# Altium project stratixboard.PrjPCB (part 1 of 2)
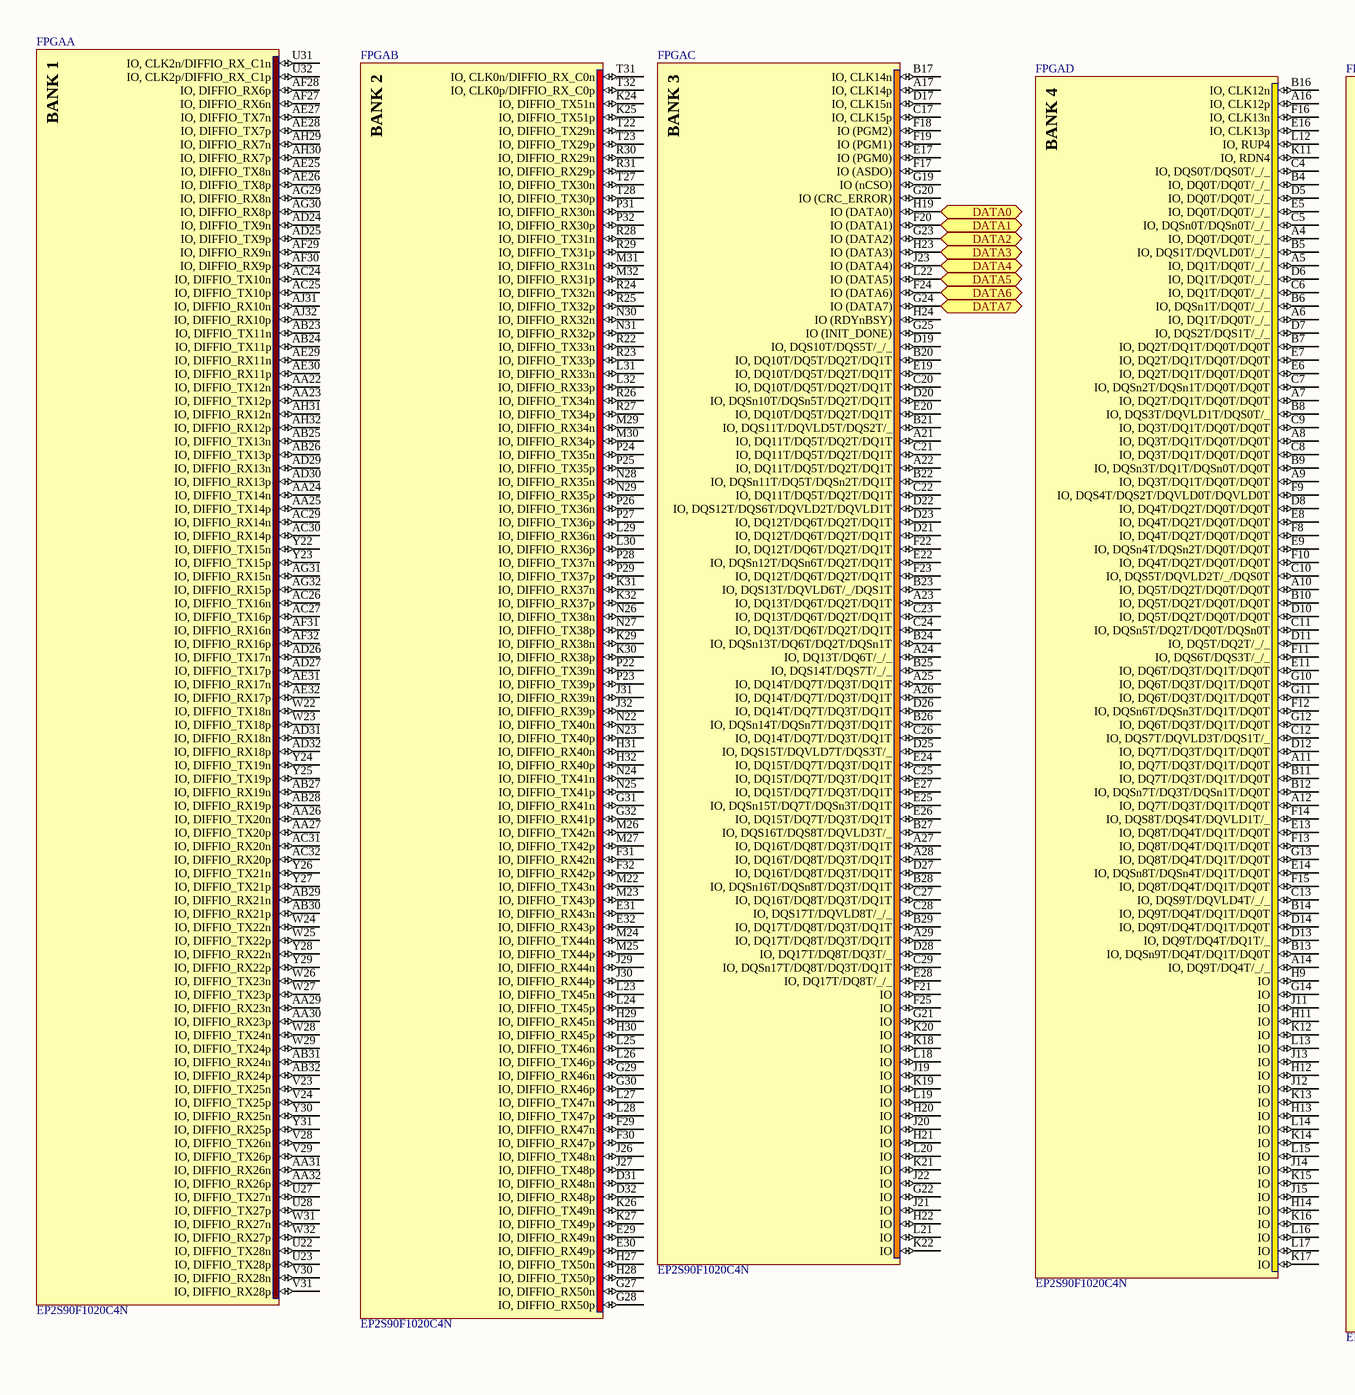
[diagram p0: IO.SchDoc, left]
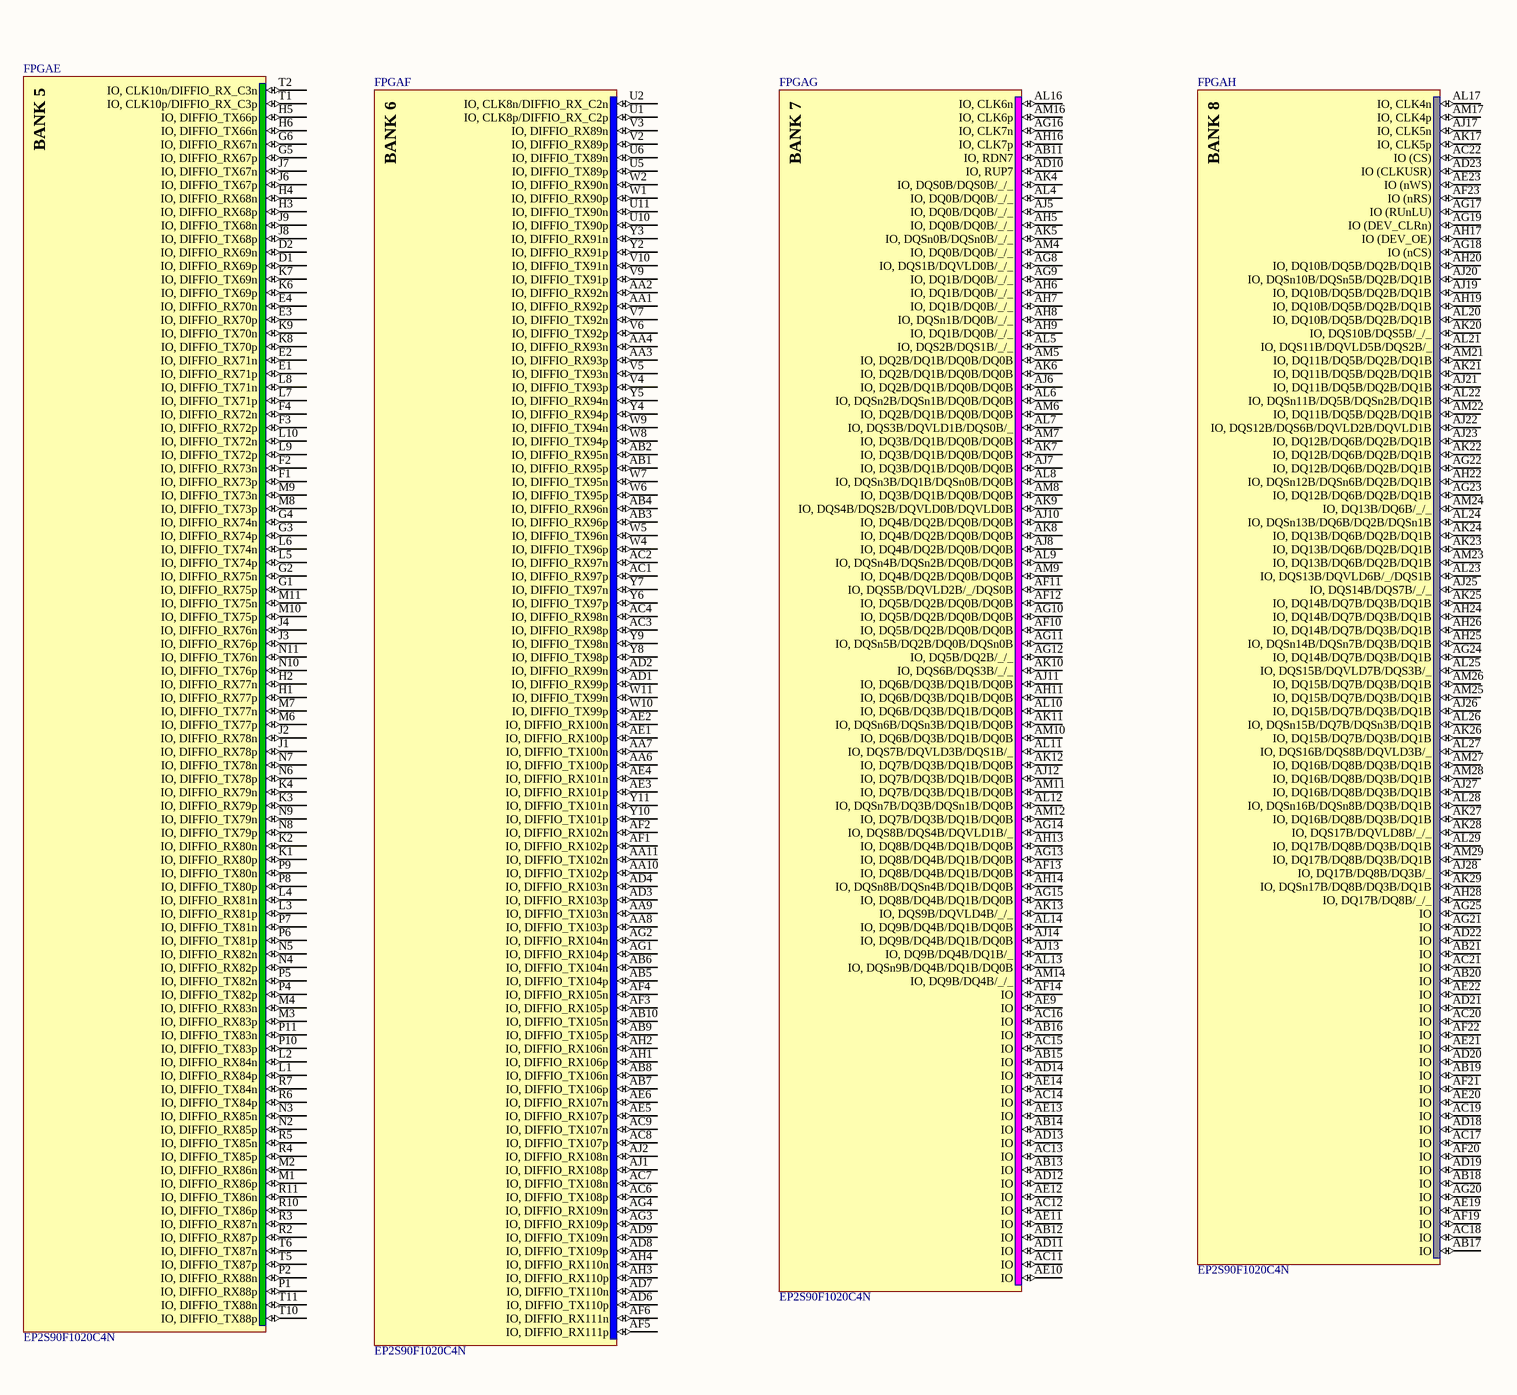
[diagram p1: IO.SchDoc, right]
8 sheets, 167 parts. Net scope: flat (ports and power ports of the same name join across sheets).
Board file: first_test.PcbDoc
Sheets:
  IO.SchDoc
  power_supply.SchDoc
  clk.SchDoc
  configuration.SchDoc
  arm.SchDoc
  ethernet.SchDoc
  memory.SchDoc
  decoupling.SchDoc

## Sheet IO.SchDoc
size A1

### Parts
FPGA  EP2S90F1020C4N  [FBGA1020]  (parts A,B,C,D,E,F,G,H of 18)

### Ports
DATA0, DATA1, DATA2, DATA3, DATA4, DATA5, DATA6, DATA7

### Nets
NetARM_66: FPGA.G24(IO_(DATA7)) ; port DATA7
NetARM_67: FPGA.F24(IO_(DATA6)) ; port DATA6
NetARM_68: FPGA.L22(IO_(DATA5)) ; port DATA5
NetARM_69: FPGA.J23(IO_(DATA4)) ; port DATA4
NetARM_70: FPGA.H23(IO_(DATA3)) ; port DATA3
NetARM_73: FPGA.G23(IO_(DATA2)) ; port DATA2
NetARM_74: FPGA.F20(IO_(DATA1)) ; port DATA1
NetARM_75: FPGA.H19(IO_(DATA0)) ; port DATA0

Not connected (* = marked no-connect by the designer): FPGA A4(IO,_DQ0T/DQ0T/_/_) A5(IO,_DQ1T/DQ0T/_/_) A6(IO,_DQ1T/DQ0T/_/_) A7(IO,_DQ2T/DQ1T/DQ0T/DQ0T) A8(IO,_DQ3T/DQ1T/DQ0T/DQ0T) A9(IO,_DQ3T/DQ1T/DQ0T/DQ0T) A10(IO,_DQ5T/DQ2T/DQ0T/DQ0T) A11(IO,_DQ7T/DQ3T/DQ1T/DQ0T) A12(IO,_DQ7T/DQ3T/DQ1T/DQ0T) A14(IO,_DQ9T/DQ4T/_/_) A16(IO,_CLK12p) A17(IO,_CLK14p) A21(IO,_DQ11T/DQ5T/DQ2T/DQ1T) A22(IO,_DQ11T/DQ5T/DQ2T/DQ1T) A23(IO,_DQ13T/DQ6T/DQ2T/DQ1T) A24(IO,_DQ13T/DQ6T/_/_) A25(IO,_DQ14T/DQ7T/DQ3T/DQ1T) A26(IO,_DQ14T/DQ7T/DQ3T/DQ1T) A27(IO,_DQ16T/DQ8T/DQ3T/DQ1T) A28(IO,_DQ16T/DQ8T/DQ3T/DQ1T) A29(IO,_DQ17T/DQ8T/DQ3T/DQ1T) AA1(IO,_DIFFIO_RX92p) AA2(IO,_DIFFIO_RX92n) AA3(IO,_DIFFIO_RX93p) AA4(IO,_DIFFIO_RX93n) AA6(IO,_DIFFIO_TX100p) AA7(IO,_DIFFIO_TX100n) AA8(IO,_DIFFIO_TX103p) AA9(IO,_DIFFIO_TX103n) AA10(IO,_DIFFIO_TX102p) AA11(IO,_DIFFIO_TX102n) AA22(IO,_DIFFIO_TX12n) AA23(IO,_DIFFIO_TX12p) AA24(IO,_DIFFIO_TX14n) AA25(IO,_DIFFIO_TX14p) AA26(IO,_DIFFIO_TX20n) AA27(IO,_DIFFIO_TX20p) AA29(IO,_DIFFIO_RX23n) AA30(IO,_DIFFIO_RX23p) AA31(IO,_DIFFIO_RX26n) AA32(IO,_DIFFIO_RX26p) AB1(IO,_DIFFIO_RX95p) AB2(IO,_DIFFIO_RX95n) AB3(IO,_DIFFIO_RX96p) AB4(IO,_DIFFIO_RX96n) AB5(IO,_DIFFIO_TX104p) AB6(IO,_DIFFIO_TX104n) AB7(IO,_DIFFIO_TX106p) AB8(IO,_DIFFIO_TX106n) AB9(IO,_DIFFIO_TX105p) AB10(IO,_DIFFIO_TX105n) AB11(IO,_RDN7) AB12(IO) AB13(IO) AB14(IO) AB15(IO) AB16(IO) AB17(IO) AB18(IO) AB19(IO) AB20(IO) AB21(IO) AB23(IO,_DIFFIO_TX11n) AB24(IO,_DIFFIO_TX11p) AB25(IO,_DIFFIO_TX13n) AB26(IO,_DIFFIO_TX13p) AB27(IO,_DIFFIO_RX19n) AB28(IO,_DIFFIO_RX19p) AB29(IO,_DIFFIO_RX21n) AB30(IO,_DIFFIO_RX21p) AB31(IO,_DIFFIO_RX24n) AB32(IO,_DIFFIO_RX24p) AC1(IO,_DIFFIO_RX97p) AC2(IO,_DIFFIO_RX97n) AC3(IO,_DIFFIO_RX98p) AC4(IO,_DIFFIO_RX98n) AC6(IO,_DIFFIO_TX108p) AC7(IO,_DIFFIO_TX108n) AC8(IO,_DIFFIO_TX107p) AC9(IO,_DIFFIO_TX107n) AC11(IO) AC12(IO) AC13(IO) AC14(IO) AC15(IO) AC16(IO) AC17(IO) AC18(IO) AC19(IO) AC20(IO) AC21(IO) AC22(IO_(CS)) AC24(IO,_DIFFIO_TX10n) AC25(IO,_DIFFIO_TX10p) AC26(IO,_DIFFIO_TX16n) AC27(IO,_DIFFIO_TX16p) AC29(IO,_DIFFIO_RX14n) AC30(IO,_DIFFIO_RX14p) AC31(IO,_DIFFIO_RX20n) AC32(IO,_DIFFIO_RX20p) AD1(IO,_DIFFIO_RX99p) AD2(IO,_DIFFIO_RX99n) AD3(IO,_DIFFIO_RX103p) AD4(IO,_DIFFIO_RX103n) AD6(IO,_DIFFIO_TX110p) AD7(IO,_DIFFIO_TX110n) AD8(IO,_DIFFIO_TX109p) AD9(IO,_DIFFIO_TX109n) AD10(IO,_RUP7) AD11(IO) AD12(IO) AD13(IO) AD14(IO) AD18(IO) AD19(IO) AD20(IO) AD21(IO) AD22(IO) AD23(IO_(CLKUSR)) AD24(IO,_DIFFIO_TX9n) AD25(IO,_DIFFIO_TX9p) AD26(IO,_DIFFIO_TX17n) AD27(IO,_DIFFIO_TX17p) AD29(IO,_DIFFIO_RX13n) AD30(IO,_DIFFIO_RX13p) AD31(IO,_DIFFIO_RX18n) AD32(IO,_DIFFIO_RX18p) AE1(IO,_DIFFIO_RX100p) AE2(IO,_DIFFIO_RX100n) AE3(IO,_DIFFIO_RX101p) AE4(IO,_DIFFIO_RX101n) AE5(IO,_DIFFIO_RX107p) AE6(IO,_DIFFIO_RX107n) AE9(IO) AE10(IO) AE11(IO) AE12(IO) AE13(IO) AE14(IO) AE19(IO) AE20(IO) AE21(IO) AE22(IO) AE23(IO_(nWS)) AE25(IO,_DIFFIO_TX8n) AE26(IO,_DIFFIO_TX8p) AE27(IO,_DIFFIO_TX7n) AE28(IO,_DIFFIO_TX7p) AE29(IO,_DIFFIO_RX11n) AE30(IO,_DIFFIO_RX11p) AE31(IO,_DIFFIO_RX17n) AE32(IO,_DIFFIO_RX17p) AF1(IO,_DIFFIO_RX102p) AF2(IO,_DIFFIO_RX102n) AF3(IO,_DIFFIO_RX105p) AF4(IO,_DIFFIO_RX105n) AF5(IO,_DIFFIO_RX111p) AF6(IO,_DIFFIO_RX111n) AF10(IO,_DQ5B/DQ2B/DQ0B/DQ0B) AF11(IO,_DQS5B/DQVLD2B/_/DQS0B) AF12(IO,_DQ5B/DQ2B/DQ0B/DQ0B) AF13(IO,_DQ8B/DQ4B/DQ1B/DQ0B) AF14(IO) AF19(IO) AF20(IO) AF21(IO) AF22(IO) AF23(IO_(nRS)) AF27(IO,_DIFFIO_RX6n) AF28(IO,_DIFFIO_RX6p) AF29(IO,_DIFFIO_RX9n) AF30(IO,_DIFFIO_RX9p) AF31(IO,_DIFFIO_RX16n) AF32(IO,_DIFFIO_RX16p) AG1(IO,_DIFFIO_RX104p) AG2(IO,_DIFFIO_RX104n) AG3(IO,_DIFFIO_RX109p) AG4(IO,_DIFFIO_RX109n) AG8(IO,_DQS1B/DQVLD0B/_/_) AG9(IO,_DQ1B/DQ0B/_/_) AG10(IO,_DQ5B/DQ2B/DQ0B/DQ0B) AG11(IO,_DQSn5B/DQ2B/DQ0B/DQSn0B) AG12(IO,_DQ5B/DQ2B/_/_) AG13(IO,_DQ8B/DQ4B/DQ1B/DQ0B) AG14(IO,_DQS8B/DQS4B/DQVLD1B/_) AG15(IO,_DQ8B/DQ4B/DQ1B/DQ0B) AG16(IO,_CLK7n) AG17(IO_(RUnLU)) AG18(IO_(nCS)) AG19(IO_(DEV_CLRn)) AG20(IO) AG21(IO) AG22(IO,_DQ12B/DQ6B/DQ2B/DQ1B) AG23(IO,_DQ12B/DQ6B/DQ2B/DQ1B) AG24(IO,_DQ14B/DQ7B/DQ3B/DQ1B) AG25(IO) AG29(IO,_DIFFIO_RX8n) AG30(IO,_DIFFIO_RX8p) AG31(IO,_DIFFIO_RX15n) AG32(IO,_DIFFIO_RX15p) AH1(IO,_DIFFIO_RX106p) AH2(IO,_DIFFIO_RX106n) AH3(IO,_DIFFIO_RX110p) AH4(IO,_DIFFIO_RX110n) AH5(IO,_DQ0B/DQ0B/_/_) AH6(IO,_DQ1B/DQ0B/_/_) AH7(IO,_DQ1B/DQ0B/_/_) AH8(IO,_DQSn1B/DQ0B/_/_) AH9(IO,_DQ1B/DQ0B/_/_) AH11(IO,_DQ6B/DQ3B/DQ1B/DQ0B) AH13(IO,_DQ8B/DQ4B/DQ1B/DQ0B) AH14(IO,_DQSn8B/DQSn4B/DQ1B/DQ0B) AH16(IO,_CLK7p) AH17(IO_(DEV_OE)) AH19(IO,_DQ10B/DQ5B/DQ2B/DQ1B) AH20(IO,_DQ10B/DQ5B/DQ2B/DQ1B) AH22(IO,_DQSn12B/DQSn6B/DQ2B/DQ1B) AH24(IO,_DQ14B/DQ7B/DQ3B/DQ1B) AH25(IO,_DQSn14B/DQSn7B/DQ3B/DQ1B) AH26(IO,_DQ14B/DQ7B/DQ3B/DQ1B) AH28(IO,_DQ17B/DQ8B/_/_) AH29(IO,_DIFFIO_RX7n) AH30(IO,_DIFFIO_RX7p) AH31(IO,_DIFFIO_RX12n) AH32(IO,_DIFFIO_RX12p) AJ1(IO,_DIFFIO_RX108p) AJ2(IO,_DIFFIO_RX108n) AJ5(IO,_DQ0B/DQ0B/_/_) AJ6(IO,_DQ2B/DQ1B/DQ0B/DQ0B) AJ7(IO,_DQ3B/DQ1B/DQ0B/DQ0B) AJ8(IO,_DQ4B/DQ2B/DQ0B/DQ0B) AJ10(IO,_DQ4B/DQ2B/DQ0B/DQ0B) AJ11(IO,_DQ6B/DQ3B/DQ1B/DQ0B) AJ12(IO,_DQ7B/DQ3B/DQ1B/DQ0B) AJ13(IO,_DQ9B/DQ4B/DQ1B/_) AJ14(IO,_DQ9B/DQ4B/DQ1B/DQ0B) AJ17(IO,_CLK5n) AJ19(IO,_DQ10B/DQ5B/DQ2B/DQ1B) AJ20(IO,_DQSn10B/DQSn5B/DQ2B/DQ1B) AJ21(IO,_DQ11B/DQ5B/DQ2B/DQ1B) AJ22(IO,_DQS12B/DQS6B/DQVLD2B/DQVLD1B) AJ23(IO,_DQ12B/DQ6B/DQ2B/DQ1B) AJ25(IO,_DQS14B/DQS7B/_/_) AJ26(IO,_DQ15B/DQ7B/DQ3B/DQ1B) AJ27(IO,_DQ16B/DQ8B/DQ3B/DQ1B) AJ28(IO,_DQ17B/DQ8B/DQ3B/_) AJ31(IO,_DIFFIO_RX10n) AJ32(IO,_DIFFIO_RX10p) AK4(IO,_DQS0B/DQS0B/_/_) AK5(IO,_DQSn0B/DQSn0B/_/_) AK6(IO,_DQ2B/DQ1B/DQ0B/DQ0B) AK7(IO,_DQ3B/DQ1B/DQ0B/DQ0B) AK8(IO,_DQ4B/DQ2B/DQ0B/DQ0B) AK9(IO,_DQS4B/DQS2B/DQVLD0B/DQVLD0B) AK10(IO,_DQS6B/DQS3B/_/_) AK11(IO,_DQSn6B/DQSn3B/DQ1B/DQ0B) AK12(IO,_DQ7B/DQ3B/DQ1B/DQ0B) AK13(IO,_DQS9B/DQVLD4B/_/_) AK17(IO,_CLK5p) AK20(IO,_DQS10B/DQS5B/_/_) AK21(IO,_DQ11B/DQ5B/DQ2B/DQ1B) AK22(IO,_DQ12B/DQ6B/DQ2B/DQ1B) AK23(IO,_DQ13B/DQ6B/DQ2B/DQ1B) AK24(IO,_DQ13B/DQ6B/DQ2B/DQ1B) AK25(IO,_DQ14B/DQ7B/DQ3B/DQ1B) AK26(IO,_DQ15B/DQ7B/DQ3B/DQ1B) AK27(IO,_DQ16B/DQ8B/DQ3B/DQ1B) AK28(IO,_DQS17B/DQVLD8B/_/_) AK29(IO,_DQSn17B/DQ8B/DQ3B/DQ1B) AL4(IO,_DQ0B/DQ0B/_/_) AL5(IO,_DQS2B/DQS1B/_/_) AL6(IO,_DQSn2B/DQSn1B/DQ0B/DQ0B) AL7(IO,_DQS3B/DQVLD1B/DQS0B/_) AL8(IO,_DQSn3B/DQ1B/DQSn0B/DQ0B) AL9(IO,_DQSn4B/DQSn2B/DQ0B/DQ0B) AL10(IO,_DQ6B/DQ3B/DQ1B/DQ0B) AL11(IO,_DQS7B/DQVLD3B/DQS1B/_) AL12(IO,_DQSn7B/DQ3B/DQSn1B/DQ0B) AL13(IO,_DQSn9B/DQ4B/DQ1B/DQ0B) AL14(IO,_DQ9B/DQ4B/DQ1B/DQ0B) AL16(IO,_CLK6n) AL17(IO,_CLK4n) AL20(IO,_DQ10B/DQ5B/DQ2B/DQ1B) AL21(IO,_DQS11B/DQVLD5B/DQS2B/_) AL22(IO,_DQSn11B/DQ5B/DQSn2B/DQ1B) AL23(IO,_DQS13B/DQVLD6B/_/DQS1B) AL24(IO,_DQSn13B/DQ6B/DQ2B/DQSn1B) AL25(IO,_DQS15B/DQVLD7B/DQS3B/_) AL26(IO,_DQSn15B/DQ7B/DQSn3B/DQ1B) AL27(IO,_DQS16B/DQS8B/DQVLD3B/_) AL28(IO,_DQSn16B/DQSn8B/DQ3B/DQ1B) AL29(IO,_DQ17B/DQ8B/DQ3B/DQ1B) AM4(IO,_DQ0B/DQ0B/_/_) AM5(IO,_DQ2B/DQ1B/DQ0B/DQ0B) AM6(IO,_DQ2B/DQ1B/DQ0B/DQ0B) AM7(IO,_DQ3B/DQ1B/DQ0B/DQ0B) AM8(IO,_DQ3B/DQ1B/DQ0B/DQ0B) AM9(IO,_DQ4B/DQ2B/DQ0B/DQ0B) AM10(IO,_DQ6B/DQ3B/DQ1B/DQ0B) AM11(IO,_DQ7B/DQ3B/DQ1B/DQ0B) AM12(IO,_DQ7B/DQ3B/DQ1B/DQ0B) AM14(IO,_DQ9B/DQ4B/_/_) AM16(IO,_CLK6p) AM17(IO,_CLK4p) AM21(IO,_DQ11B/DQ5B/DQ2B/DQ1B) AM22(IO,_DQ11B/DQ5B/DQ2B/DQ1B) AM23(IO,_DQ13B/DQ6B/DQ2B/DQ1B) AM24(IO,_DQ13B/DQ6B/_/_) AM25(IO,_DQ15B/DQ7B/DQ3B/DQ1B) AM26(IO,_DQ15B/DQ7B/DQ3B/DQ1B) AM27(IO,_DQ16B/DQ8B/DQ3B/DQ1B) AM28(IO,_DQ16B/DQ8B/DQ3B/DQ1B) AM29(IO,_DQ17B/DQ8B/DQ3B/DQ1B) B4(IO,_DQ0T/DQ0T/_/_) B5(IO,_DQS1T/DQVLD0T/_/_) B6(IO,_DQSn1T/DQ0T/_/_) B7(IO,_DQ2T/DQ1T/DQ0T/DQ0T) B8(IO,_DQS3T/DQVLD1T/DQS0T/_) B9(IO,_DQSn3T/DQ1T/DQSn0T/DQ0T) B10(IO,_DQ5T/DQ2T/DQ0T/DQ0T) B11(IO,_DQ7T/DQ3T/DQ1T/DQ0T) B12(IO,_DQSn7T/DQ3T/DQSn1T/DQ0T) B13(IO,_DQSn9T/DQ4T/DQ1T/DQ0T) B14(IO,_DQ9T/DQ4T/DQ1T/DQ0T) B16(IO,_CLK12n) B17(IO,_CLK14n) B20(IO,_DQ10T/DQ5T/DQ2T/DQ1T) B21(IO,_DQS11T/DQVLD5T/DQS2T/_) B22(IO,_DQSn11T/DQ5T/DQSn2T/DQ1T) B23(IO,_DQS13T/DQVLD6T/_/DQS1T) B24(IO,_DQSn13T/DQ6T/DQ2T/DQSn1T) B25(IO,_DQS14T/DQS7T/_/_) B26(IO,_DQSn14T/DQSn7T/DQ3T/DQ1T) B27(IO,_DQS16T/DQS8T/DQVLD3T/_) B28(IO,_DQSn16T/DQSn8T/DQ3T/DQ1T) B29(IO,_DQ17T/DQ8T/DQ3T/DQ1T) C4(IO,_DQS0T/DQS0T/_/_) C5(IO,_DQSn0T/DQSn0T/_/_) C6(IO,_DQ1T/DQ0T/_/_) C7(IO,_DQSn2T/DQSn1T/DQ0T/DQ0T) C8(IO,_DQ3T/DQ1T/DQ0T/DQ0T) C9(IO,_DQ3T/DQ1T/DQ0T/DQ0T) C10(IO,_DQS5T/DQVLD2T/_/DQS0T) C11(IO,_DQSn5T/DQ2T/DQ0T/DQSn0T) C12(IO,_DQS7T/DQVLD3T/DQS1T/_) C13(IO,_DQS9T/DQVLD4T/_/_) C17(IO,_CLK15p) C20(IO,_DQ10T/DQ5T/DQ2T/DQ1T) C21(IO,_DQ11T/DQ5T/DQ2T/DQ1T) C22(IO,_DQ11T/DQ5T/DQ2T/DQ1T) C23(IO,_DQ13T/DQ6T/DQ2T/DQ1T) C24(IO,_DQ13T/DQ6T/DQ2T/DQ1T) C25(IO,_DQ15T/DQ7T/DQ3T/DQ1T) C26(IO,_DQ14T/DQ7T/DQ3T/DQ1T) C27(IO,_DQ16T/DQ8T/DQ3T/DQ1T) C28(IO,_DQS17T/DQVLD8T/_/_) C29(IO,_DQSn17T/DQ8T/DQ3T/DQ1T) D1(IO,_DIFFIO_RX69p) D2(IO,_DIFFIO_RX69n) D5(IO,_DQ0T/DQ0T/_/_) D6(IO,_DQ1T/DQ0T/_/_) D7(IO,_DQS2T/DQS1T/_/_) D8(IO,_DQ4T/DQ2T/DQ0T/DQ0T) D10(IO,_DQ5T/DQ2T/DQ0T/DQ0T) D11(IO,_DQ5T/DQ2T/_/_) D12(IO,_DQ7T/DQ3T/DQ1T/DQ0T) D13(IO,_DQ9T/DQ4T/DQ1T/_) D14(IO,_DQ9T/DQ4T/DQ1T/DQ0T) D17(IO,_CLK15n) D19(IO,_DQS10T/DQS5T/_/_) D20(IO,_DQSn10T/DQSn5T/DQ2T/DQ1T) D21(IO,_DQ12T/DQ6T/DQ2T/DQ1T) D22(IO,_DQS12T/DQS6T/DQVLD2T/DQVLD1T) D23(IO,_DQ12T/DQ6T/DQ2T/DQ1T) D25(IO,_DQS15T/DQVLD7T/DQS3T/_) D26(IO,_DQ14T/DQ7T/DQ3T/DQ1T) D27(IO,_DQ16T/DQ8T/DQ3T/DQ1T) D28(IO,_DQ17T/DQ8T/DQ3T/_) D31(IO,_DIFFIO_RX48n) D32(IO,_DIFFIO_RX48p) E1(IO,_DIFFIO_RX71p) E2(IO,_DIFFIO_RX71n) E3(IO,_DIFFIO_RX70p) E4(IO,_DIFFIO_RX70n) E5(IO,_DQ0T/DQ0T/_/_) E6(IO,_DQ2T/DQ1T/DQ0T/DQ0T) E7(IO,_DQ2T/DQ1T/DQ0T/DQ0T) E8(IO,_DQ4T/DQ2T/DQ0T/DQ0T) E9(IO,_DQSn4T/DQSn2T/DQ0T/DQ0T) E11(IO,_DQ6T/DQ3T/DQ1T/DQ0T) E13(IO,_DQ8T/DQ4T/DQ1T/DQ0T) E14(IO,_DQSn8T/DQSn4T/DQ1T/DQ0T) E16(IO,_CLK13p) E17(IO_(PGM0)) E19(IO,_DQ10T/DQ5T/DQ2T/DQ1T) E20(IO,_DQ10T/DQ5T/DQ2T/DQ1T) E22(IO,_DQSn12T/DQSn6T/DQ2T/DQ1T) E24(IO,_DQ15T/DQ7T/DQ3T/DQ1T) E25(IO,_DQSn15T/DQ7T/DQSn3T/DQ1T) E26(IO,_DQ15T/DQ7T/DQ3T/DQ1T) E27(IO,_DQ15T/DQ7T/DQ3T/DQ1T) E28(IO,_DQ17T/DQ8T/_/_) E29(IO,_DIFFIO_RX49n) E30(IO,_DIFFIO_RX49p) E31(IO,_DIFFIO_RX43n) E32(IO,_DIFFIO_RX43p) F1(IO,_DIFFIO_RX73p) F2(IO,_DIFFIO_RX73n) F3(IO,_DIFFIO_RX72p) F4(IO,_DIFFIO_RX72n) F8(IO,_DQ4T/DQ2T/DQ0T/DQ0T) F9(IO,_DQS4T/DQS2T/DQVLD0T/DQVLD0T) F10(IO,_DQ4T/DQ2T/DQ0T/DQ0T) F11(IO,_DQS6T/DQS3T/_/_) F12(IO,_DQSn6T/DQSn3T/DQ1T/DQ0T) F13(IO,_DQ8T/DQ4T/DQ1T/DQ0T) F14(IO,_DQS8T/DQS4T/DQVLD1T/_) F15(IO,_DQ8T/DQ4T/DQ1T/DQ0T) F16(IO,_CLK13n) F17(IO_(ASDO)) F18(IO_(PGM2)) F19(IO_(PGM1)) F21(IO) F22(IO,_DQ12T/DQ6T/DQ2T/DQ1T) F23(IO,_DQ12T/DQ6T/DQ2T/DQ1T) F25(IO) F29(IO,_DIFFIO_RX47n) F30(IO,_DIFFIO_RX47p) F31(IO,_DIFFIO_RX42n) F32(IO,_DIFFIO_RX42p) G1(IO,_DIFFIO_RX75p) G2(IO,_DIFFIO_RX75n) G3(IO,_DIFFIO_RX74p) G4(IO,_DIFFIO_RX74n) G5(IO,_DIFFIO_RX67p) G6(IO,_DIFFIO_RX67n) G10(IO,_DQ6T/DQ3T/DQ1T/DQ0T) G11(IO,_DQ6T/DQ3T/DQ1T/DQ0T) G12(IO,_DQ6T/DQ3T/DQ1T/DQ0T) G13(IO,_DQ8T/DQ4T/DQ1T/DQ0T) G14(IO) G19(IO_(nCSO)) G20(IO_(CRC_ERROR)) G21(IO) G22(IO) G25(IO_(INIT_DONE)) G27(IO,_DIFFIO_RX50n) G28(IO,_DIFFIO_RX50p) G29(IO,_DIFFIO_RX46n) G30(IO,_DIFFIO_RX46p) G31(IO,_DIFFIO_RX41n) G32(IO,_DIFFIO_RX41p) H1(IO,_DIFFIO_RX77p) H2(IO,_DIFFIO_RX77n) H3(IO,_DIFFIO_RX68p) H4(IO,_DIFFIO_RX68n) H5(IO,_DIFFIO_TX66p) H6(IO,_DIFFIO_TX66n) H9(IO) H11(IO) H12(IO) H13(IO) H14(IO) H20(IO) H21(IO) H22(IO) H24(IO_(RDYnBSY)) H27(IO,_DIFFIO_TX50n) H28(IO,_DIFFIO_TX50p) H29(IO,_DIFFIO_RX45n) H30(IO,_DIFFIO_RX45p) H31(IO,_DIFFIO_RX40n) H32(IO,_DIFFIO_RX40p) J1(IO,_DIFFIO_RX78p) J2(IO,_DIFFIO_RX78n) J3(IO,_DIFFIO_RX76p) J4(IO,_DIFFIO_RX76n) J6(IO,_DIFFIO_TX67p) J7(IO,_DIFFIO_TX67n) J8(IO,_DIFFIO_TX68p) J9(IO,_DIFFIO_TX68n) J11(IO) J12(IO) J13(IO) J14(IO) J15(IO) J19(IO) J20(IO) J21(IO) J22(IO) J26(IO,_DIFFIO_TX48n) J27(IO,_DIFFIO_TX48p) J29(IO,_DIFFIO_RX44n) J30(IO,_DIFFIO_RX44p) J31(IO,_DIFFIO_RX39n) J32(IO,_DIFFIO_RX39p) K1(IO,_DIFFIO_RX80p) K2(IO,_DIFFIO_RX80n) K3(IO,_DIFFIO_RX79p) K4(IO,_DIFFIO_RX79n) K6(IO,_DIFFIO_TX69p) K7(IO,_DIFFIO_TX69n) K8(IO,_DIFFIO_TX70p) K9(IO,_DIFFIO_TX70n) K11(IO,_RDN4) K12(IO) K13(IO) K14(IO) K15(IO) K16(IO) K17(IO) K18(IO) K19(IO) K20(IO) K21(IO) K22(IO) K24(IO,_DIFFIO_TX51n) K25(IO,_DIFFIO_TX51p) K26(IO,_DIFFIO_TX49n) K27(IO,_DIFFIO_TX49p) K29(IO,_DIFFIO_RX38n) K30(IO,_DIFFIO_RX38p) K31(IO,_DIFFIO_RX37n) K32(IO,_DIFFIO_RX37p) L1(IO,_DIFFIO_RX84p) L2(IO,_DIFFIO_RX84n) L3(IO,_DIFFIO_RX81p) L4(IO,_DIFFIO_RX81n) L5(IO,_DIFFIO_TX74p) L6(IO,_DIFFIO_TX74n) L7(IO,_DIFFIO_TX71p) L8(IO,_DIFFIO_TX71n) L9(IO,_DIFFIO_TX72p) L10(IO,_DIFFIO_TX72n) L12(IO,_RUP4) L13(IO) L14(IO) L15(IO) L16(IO) L17(IO) L18(IO) L19(IO) L20(IO) L21(IO) L23(IO,_DIFFIO_TX45n) L24(IO,_DIFFIO_TX45p) L25(IO,_DIFFIO_TX46n) L26(IO,_DIFFIO_TX46p) L27(IO,_DIFFIO_TX47n) L28(IO,_DIFFIO_TX47p) L29(IO,_DIFFIO_RX36n) L30(IO,_DIFFIO_RX36p) L31(IO,_DIFFIO_RX33n) L32(IO,_DIFFIO_RX33p) M1(IO,_DIFFIO_RX86p) M2(IO,_DIFFIO_RX86n) M3(IO,_DIFFIO_RX83p) M4(IO,_DIFFIO_RX83n) M6(IO,_DIFFIO_TX77p) M7(IO,_DIFFIO_TX77n) M8(IO,_DIFFIO_TX73p) M9(IO,_DIFFIO_TX73n) M10(IO,_DIFFIO_TX75p) M11(IO,_DIFFIO_TX75n) M22(IO,_DIFFIO_TX43n) M23(IO,_DIFFIO_TX43p) M24(IO,_DIFFIO_TX44n) M25(IO,_DIFFIO_TX44p) M26(IO,_DIFFIO_TX42n) M27(IO,_DIFFIO_TX42p) M29(IO,_DIFFIO_RX34n) M30(IO,_DIFFIO_RX34p) M31(IO,_DIFFIO_RX31n) M32(IO,_DIFFIO_RX31p) N2(IO,_DIFFIO_RX85p) N3(IO,_DIFFIO_RX85n) N4(IO,_DIFFIO_RX82p) N5(IO,_DIFFIO_RX82n) N6(IO,_DIFFIO_TX78p) N7(IO,_DIFFIO_TX78n) N8(IO,_DIFFIO_TX79p) N9(IO,_DIFFIO_TX79n) N10(IO,_DIFFIO_TX76p) N11(IO,_DIFFIO_TX76n) N22(IO,_DIFFIO_TX40n) N23(IO,_DIFFIO_TX40p) N24(IO,_DIFFIO_TX41n) N25(IO,_DIFFIO_TX41p) N26(IO,_DIFFIO_TX38n) N27(IO,_DIFFIO_TX38p) N28(IO,_DIFFIO_RX35n) N29(IO,_DIFFIO_RX35p) N30(IO,_DIFFIO_RX32n) N31(IO,_DIFFIO_RX32p) P1(IO,_DIFFIO_RX88p) P2(IO,_DIFFIO_RX88n) P4(IO,_DIFFIO_TX82p) P5(IO,_DIFFIO_TX82n) P6(IO,_DIFFIO_TX81p) P7(IO,_DIFFIO_TX81n) P8(IO,_DIFFIO_TX80p) P9(IO,_DIFFIO_TX80n) P10(IO,_DIFFIO_TX83p) P11(IO,_DIFFIO_TX83n) P22(IO,_DIFFIO_TX39n) P23(IO,_DIFFIO_TX39p) P24(IO,_DIFFIO_TX35n) P25(IO,_DIFFIO_TX35p) P26(IO,_DIFFIO_TX36n) P27(IO,_DIFFIO_TX36p) P28(IO,_DIFFIO_TX37n) P29(IO,_DIFFIO_TX37p) P31(IO,_DIFFIO_RX30n) P32(IO,_DIFFIO_RX30p) R2(IO,_DIFFIO_RX87p) R3(IO,_DIFFIO_RX87n) R4(IO,_DIFFIO_TX85p) R5(IO,_DIFFIO_TX85n) R6(IO,_DIFFIO_TX84p) R7(IO,_DIFFIO_TX84n) R10(IO,_DIFFIO_TX86p) R11(IO,_DIFFIO_TX86n) R22(IO,_DIFFIO_TX33n) R23(IO,_DIFFIO_TX33p) R24(IO,_DIFFIO_TX32n) R25(IO,_DIFFIO_TX32p) R26(IO,_DIFFIO_TX34n) R27(IO,_DIFFIO_TX34p) R28(IO,_DIFFIO_TX31n) R29(IO,_DIFFIO_TX31p) R30(IO,_DIFFIO_RX29n) R31(IO,_DIFFIO_RX29p) T1(IO,_CLK10p/DIFFIO_RX_C3p) T2(IO,_CLK10n/DIFFIO_RX_C3n) T5(IO,_DIFFIO_TX87p) T6(IO,_DIFFIO_TX87n) T10(IO,_DIFFIO_TX88p) T11(IO,_DIFFIO_TX88n) T22(IO,_DIFFIO_TX29n) T23(IO,_DIFFIO_TX29p) T27(IO,_DIFFIO_TX30n) T28(IO,_DIFFIO_TX30p) T31(IO,_CLK0n/DIFFIO_RX_C0n) T32(IO,_CLK0p/DIFFIO_RX_C0p) U1(IO,_CLK8p/DIFFIO_RX_C2p) U2(IO,_CLK8n/DIFFIO_RX_C2n) U5(IO,_DIFFIO_TX89p) U6(IO,_DIFFIO_TX89n) U10(IO,_DIFFIO_TX90p) U11(IO,_DIFFIO_TX90n) U22(IO,_DIFFIO_TX28n) U23(IO,_DIFFIO_TX28p) U27(IO,_DIFFIO_TX27n) U28(IO,_DIFFIO_TX27p) U31(IO,_CLK2n/DIFFIO_RX_C1n) U32(IO,_CLK2p/DIFFIO_RX_C1p) V2(IO,_DIFFIO_RX89p) V3(IO,_DIFFIO_RX89n) V4(IO,_DIFFIO_TX93p) V5(IO,_DIFFIO_TX93n) V6(IO,_DIFFIO_TX92p) V7(IO,_DIFFIO_TX92n) V9(IO,_DIFFIO_TX91p) V10(IO,_DIFFIO_TX91n) V23(IO,_DIFFIO_TX25n) V24(IO,_DIFFIO_TX25p) V28(IO,_DIFFIO_TX26n) V29(IO,_DIFFIO_TX26p) V30(IO,_DIFFIO_RX28n) V31(IO,_DIFFIO_RX28p) W1(IO,_DIFFIO_RX90p) W2(IO,_DIFFIO_RX90n) W4(IO,_DIFFIO_TX96p) W5(IO,_DIFFIO_TX96n) W6(IO,_DIFFIO_TX95p) W7(IO,_DIFFIO_TX95n) W8(IO,_DIFFIO_TX94p) W9(IO,_DIFFIO_TX94n) W10(IO,_DIFFIO_TX99p) W11(IO,_DIFFIO_TX99n) W22(IO,_DIFFIO_TX18n) W23(IO,_DIFFIO_TX18p) W24(IO,_DIFFIO_TX22n) W25(IO,_DIFFIO_TX22p) W26(IO,_DIFFIO_TX23n) W27(IO,_DIFFIO_TX23p) W28(IO,_DIFFIO_TX24n) W29(IO,_DIFFIO_TX24p) W31(IO,_DIFFIO_RX27n) W32(IO,_DIFFIO_RX27p) Y2(IO,_DIFFIO_RX91p) Y3(IO,_DIFFIO_RX91n) Y4(IO,_DIFFIO_RX94p) Y5(IO,_DIFFIO_RX94n) Y6(IO,_DIFFIO_TX97p) Y7(IO,_DIFFIO_TX97n) Y8(IO,_DIFFIO_TX98p) Y9(IO,_DIFFIO_TX98n) Y10(IO,_DIFFIO_TX101p) Y11(IO,_DIFFIO_TX101n) Y22(IO,_DIFFIO_TX15n) Y23(IO,_DIFFIO_TX15p) Y24(IO,_DIFFIO_TX19n) Y25(IO,_DIFFIO_TX19p) Y26(IO,_DIFFIO_TX21n) Y27(IO,_DIFFIO_TX21p) Y28(IO,_DIFFIO_RX22n) Y29(IO,_DIFFIO_RX22p) Y30(IO,_DIFFIO_RX25n) Y31(IO,_DIFFIO_RX25p)

### Notes on the sheet
- (in symbol EP2S90F1020C4N, part A) BANK 1
- (in symbol EP2S90F1020C4N, part B) BANK 2
- (in symbol EP2S90F1020C4N, part C) BANK 3
- (in symbol EP2S90F1020C4N, part D) BANK 4
- (in symbol EP2S90F1020C4N, part E) BANK 5
- (in symbol EP2S90F1020C4N, part F) BANK 6
- (in symbol EP2S90F1020C4N, part G) BANK 7
- (in symbol EP2S90F1020C4N, part H) BANK 8

### Library data of the parts
FPGA = EP2S90F1020C4N: Stratix II 1.2V FPGA, 758 I/Os, 1020-Pin FineLine BGA, Speed Grade 4, Commercial Grade, Pb-Free; Note: DQS signal pins in banks 3, 4, 7 & 8 named according to DQ bus modes. "/" separates each mode. ie. Mode x4, x8/x9, x16/x18 and x32/x36.; Published: 8-Jul-2005; LatestRevisionDate: 13-Apr-2006; LatestRevisionNote: IPC-7351 Footprint Added.; DatasheetVersion: ver4.3, Jan-2008; PackageVersion: ver15.1, May-2008; PackageReference: FBGA1020; Publisher: Altium Limited; PackageDescription: 1020-Ball FineLine Ball Grid Array (FBGA1020) - Flip Chip; Code_JEDEC: MS-034-AAP-1; ComponentLink1Description: Manufacturer Link; ComponentLink1URL: http://www.altera.com/products/devices/stratix2/st2-index.jsp; ComponentLink2Description: Handbook; ComponentLink2URL: http://www.altera.com/literature/hb/stx2/stratix2_handbook.pdf; ComponentLink3Description: Packaging Specification; ComponentLink3URL: http://www.altera.com/literature/ds/dspkg.pdf

## Sheet power_supply.SchDoc
size A2
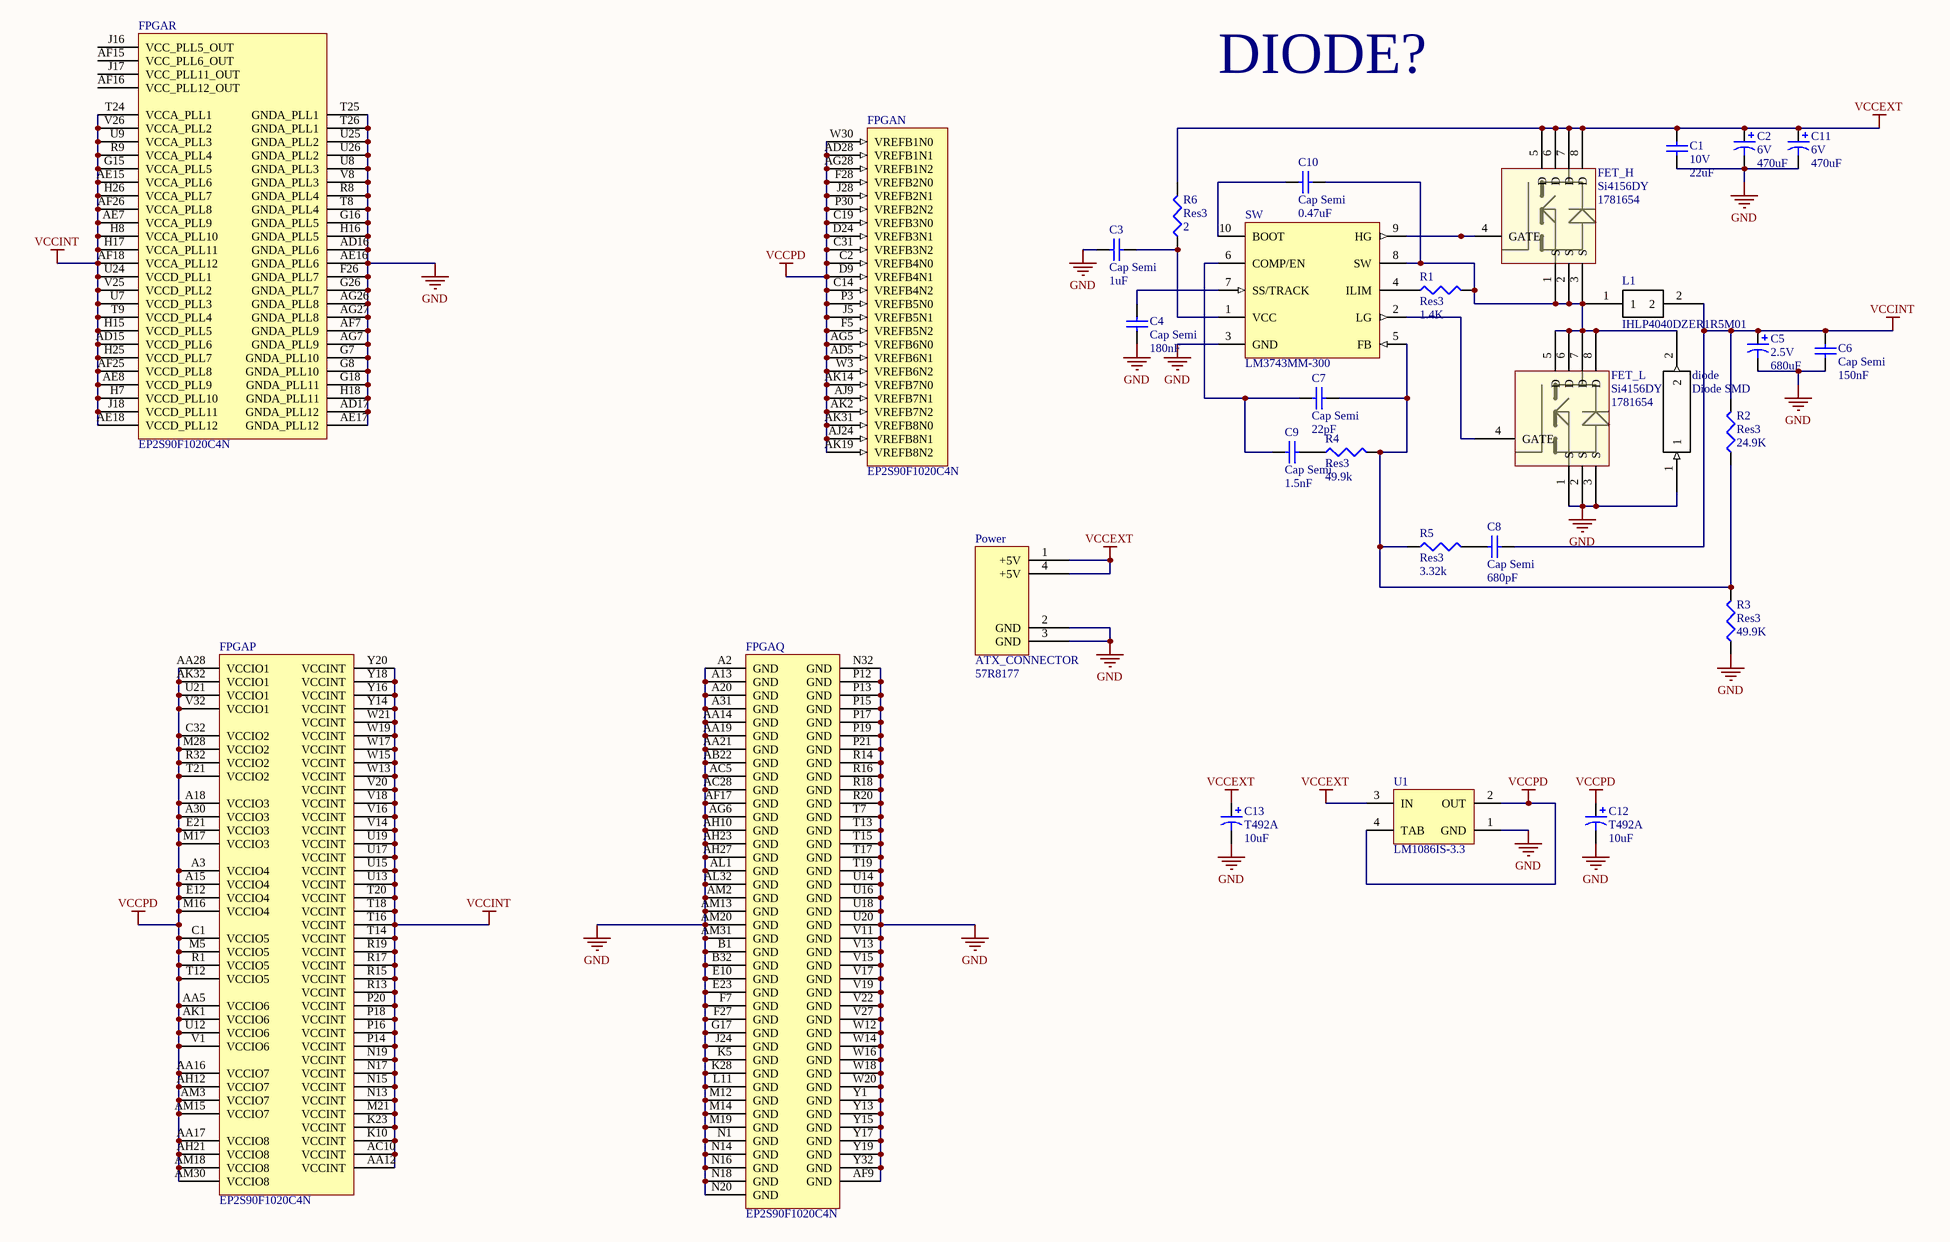
[diagram p2: power_supply.SchDoc]

### Parts
C1  10V  value 22uF  [CAPC3225L]
C2  6V  value 470uF  [E]
C3  Cap Semi  value 1uF  [2012[0805]]
C4  Cap Semi  value 180nF  [2012[0805]]
C5  2.5V  value 680uF  [E]
C6  Cap Semi  value 150nF  [2012[0805]]
C7  Cap Semi  value 22pF  [CAPC1608L]
C8  Cap Semi  value 680pF  [CAPC1608L]
C9  Cap Semi  value 1.5nF  [CAPC1608L]
C10  Cap Semi  value 0.47uF  [2012[0805]]
C11  6V  value 470uF  [E]
C12  T492A  value 10uF  [A]
C13  T492A  value 10uF  [A]
diode  Diode SMD  [Diode SMD]
FET_H  Si4156DY  Supplier Part Number 1: 1781654  [SO-8C_M]
FET_L  Si4156DY  Supplier Part Number 1: 1781654  [SO-8C_M]
FPGA  EP2S90F1020C4N  [FBGA1020]  (parts N,P,Q,R of 18)
L1  IHLP4040DZER1R5M01  [IHLP4040DZER1R5M01]
Power  ATX_CONNECTOR  Supplier Part Number 1: 57R8177  [Molex 8981]
R1  Res3  value 1.4K  [RESC1608L]
R2  Res3  value 24.9K  [RESC1608L]
R3  Res3  value 49.9K  [RESC1608L]
R4  Res3  value 49.9k  [RESC1608L]
R5  Res3  value 3.32k  [RESC1608L]
R6  Res3  value 2  [RESC1608L]
SW  LM3743MM-300  [MUB10A_N]
U1  LM1086IS-3.3  [TS3B_N]

### Nets
GND: C1.2 C2.2 C3.2 C4.1 C5.2 C6.1 C11.2 C12.2 C13.2 diode.1 FET_L.1(S) FET_L.2(S) FET_L.3(S) FPGA.A2(GND) FPGA.A13(GND) FPGA.A20(GND) FPGA.A31(GND) FPGA.AA14(GND) FPGA.AA19(GND) FPGA.AA21(GND) FPGA.AB22(GND) FPGA.AC5(GND) FPGA.AC28(GND) FPGA.AD16(GNDA_PLL6) FPGA.AD17(GNDA_PLL12) FPGA.AE16(GNDA_PLL6) FPGA.AE17(GNDA_PLL12) FPGA.AF7(GNDA_PLL9) FPGA.AF9(GND) FPGA.AF17(GND) FPGA.AG6(GND) FPGA.AG7(GNDA_PLL9) FPGA.AG26(GNDA_PLL8) FPGA.AG27(GNDA_PLL8) FPGA.AH10(GND) FPGA.AH23(GND) FPGA.AH27(GND) FPGA.AL1(GND) FPGA.AL32(GND) FPGA.AM2(GND) FPGA.AM13(GND) FPGA.AM20(GND) FPGA.AM31(GND) FPGA.B1(GND) FPGA.B32(GND) FPGA.E10(GND) FPGA.E23(GND) FPGA.F7(GND) FPGA.F26(GNDA_PLL7) FPGA.F27(GND) FPGA.G7(GNDA_PLL10) FPGA.G8(GNDA_PLL10) FPGA.G16(GNDA_PLL5) FPGA.G17(GND) FPGA.G18(GNDA_PLL11) FPGA.G26(GNDA_PLL7) FPGA.H16(GNDA_PLL5) FPGA.H18(GNDA_PLL11) FPGA.J24(GND) FPGA.K5(GND) FPGA.K28(GND) FPGA.L11(GND) FPGA.M12(GND) FPGA.M14(GND) FPGA.M19(GND) FPGA.N1(GND) FPGA.N14(GND) FPGA.N16(GND) FPGA.N18(GND) FPGA.N20(GND) FPGA.N32(GND) FPGA.P12(GND) FPGA.P13(GND) FPGA.P15(GND) FPGA.P17(GND) FPGA.P19(GND) FPGA.P21(GND) FPGA.R8(GNDA_PLL4) FPGA.R14(GND) FPGA.R16(GND) FPGA.R18(GND) FPGA.R20(GND) FPGA.T7(GND) FPGA.T8(GNDA_PLL4) FPGA.T13(GND) FPGA.T15(GND) FPGA.T17(GND) FPGA.T19(GND) FPGA.T25(GNDA_PLL1) FPGA.T26(GNDA_PLL1) FPGA.U8(GNDA_PLL3) FPGA.U14(GND) FPGA.U16(GND) FPGA.U18(GND) FPGA.U20(GND) FPGA.U25(GNDA_PLL2) FPGA.U26(GNDA_PLL2) FPGA.V8(GNDA_PLL3) FPGA.V11(GND) FPGA.V13(GND) FPGA.V15(GND) FPGA.V17(GND) FPGA.V19(GND) FPGA.V22(GND) FPGA.V27(GND) FPGA.W12(GND) FPGA.W14(GND) FPGA.W16(GND) FPGA.W18(GND) FPGA.W20(GND) FPGA.Y1(GND) FPGA.Y13(GND) FPGA.Y15(GND) FPGA.Y17(GND) FPGA.Y19(GND) FPGA.Y32(GND) Power.2(GND) Power.3(GND) R3.1 SW.3(GND) U1.1(GND)
VCCEXT: C1.1 C2.1 C11.1 C13.1 FET_H.5(D) FET_H.6(D) FET_H.7(D) FET_H.8(D) Power.1(+5V) Power.4(+5V) R6.2 U1.3(IN)
VCCINT: C5.1 C6.2 C8.1 FPGA.AA12(VCCINT) FPGA.AC10(VCCINT) FPGA.AD15(VCCD_PLL6) FPGA.AE7(VCCA_PLL9) FPGA.AE8(VCCD_PLL9) FPGA.AE15(VCCA_PLL6) FPGA.AE18(VCCD_PLL12) FPGA.AF18(VCCA_PLL12) FPGA.AF25(VCCD_PLL8) FPGA.AF26(VCCA_PLL8) FPGA.G15(VCCA_PLL5) FPGA.H7(VCCD_PLL10) FPGA.H8(VCCA_PLL10) FPGA.H15(VCCD_PLL5) FPGA.H17(VCCA_PLL11) FPGA.H25(VCCD_PLL7) FPGA.H26(VCCA_PLL7) FPGA.J18(VCCD_PLL11) FPGA.K10(VCCINT) FPGA.K23(VCCINT) FPGA.M21(VCCINT) FPGA.N13(VCCINT) FPGA.N15(VCCINT) FPGA.N17(VCCINT) FPGA.N19(VCCINT) FPGA.P14(VCCINT) FPGA.P16(VCCINT) FPGA.P18(VCCINT) FPGA.P20(VCCINT) FPGA.R9(VCCA_PLL4) FPGA.R13(VCCINT) FPGA.R15(VCCINT) FPGA.R17(VCCINT) FPGA.R19(VCCINT) FPGA.T9(VCCD_PLL4) FPGA.T14(VCCINT) FPGA.T16(VCCINT) FPGA.T18(VCCINT) FPGA.T20(VCCINT) FPGA.T24(VCCA_PLL1) FPGA.U7(VCCD_PLL3) FPGA.U9(VCCA_PLL3) FPGA.U13(VCCINT) FPGA.U15(VCCINT) FPGA.U17(VCCINT) FPGA.U19(VCCINT) FPGA.U24(VCCD_PLL1) FPGA.V14(VCCINT) FPGA.V16(VCCINT) FPGA.V18(VCCINT) FPGA.V20(VCCINT) FPGA.V25(VCCD_PLL2) FPGA.V26(VCCA_PLL2) FPGA.W13(VCCINT) FPGA.W15(VCCINT) FPGA.W17(VCCINT) FPGA.W19(VCCINT) FPGA.W21(VCCINT) FPGA.Y14(VCCINT) FPGA.Y16(VCCINT) FPGA.Y18(VCCINT) FPGA.Y20(VCCINT) L1.2 R2.2
VCCPD: C12.1 FPGA.A3(VCCIO4) FPGA.A15(VCCIO4) FPGA.A18(VCCIO3) FPGA.A30(VCCIO3) FPGA.AA5(VCCIO6) FPGA.AA16(VCCIO7) FPGA.AA17(VCCIO8) FPGA.AA28(VCCIO1) FPGA.AD5(VREFB6N1) FPGA.AD28(VREFB1N1) FPGA.AG5(VREFB6N0) FPGA.AG28(VREFB1N2) FPGA.AH12(VCCIO7) FPGA.AH21(VCCIO8) FPGA.AJ9(VREFB7N1) FPGA.AJ24(VREFB8N1) FPGA.AK1(VCCIO6) FPGA.AK2(VREFB7N2) FPGA.AK14(VREFB7N0) FPGA.AK19(VREFB8N2) FPGA.AK31(VREFB8N0) FPGA.AK32(VCCIO1) FPGA.AM3(VCCIO7) FPGA.AM15(VCCIO7) FPGA.AM18(VCCIO8) FPGA.AM30(VCCIO8) FPGA.C1(VCCIO5) FPGA.C2(VREFB4N0) FPGA.C14(VREFB4N2) FPGA.C19(VREFB3N0) FPGA.C31(VREFB3N2) FPGA.C32(VCCIO2) FPGA.D9(VREFB4N1) FPGA.D24(VREFB3N1) FPGA.E12(VCCIO4) FPGA.E21(VCCIO3) FPGA.F5(VREFB5N2) FPGA.F28(VREFB2N0) FPGA.J5(VREFB5N1) FPGA.J28(VREFB2N1) FPGA.M5(VCCIO5) FPGA.M16(VCCIO4) FPGA.M17(VCCIO3) FPGA.M28(VCCIO2) FPGA.P3(VREFB5N0) FPGA.P30(VREFB2N2) FPGA.R1(VCCIO5) FPGA.R32(VCCIO2) FPGA.T12(VCCIO5) FPGA.T21(VCCIO2) FPGA.U12(VCCIO6) FPGA.U21(VCCIO1) FPGA.V1(VCCIO6) FPGA.V32(VCCIO1) FPGA.W3(VREFB6N2) FPGA.W30(VREFB1N0) U1.2(OUT) U1.4(TAB)
NetC3_1: C3.1 R6.1 SW.1(VCC)
NetC4_2: C4.2 SW.7(SS/TRACK)
NetC7_1: C7.1 R2.1 R3.2 R4.2 R5.1 SW.5(FB)
NetC7_2: C7.2 C9.2 SW.6(COMP/EN)
NetC8_2: C8.2 R5.2
NetC9_1: C9.1 R4.1
NetC10_1: C10.1 diode.2 FET_H.1(S) FET_H.2(S) FET_H.3(S) FET_L.5(D) FET_L.6(D) FET_L.7(D) FET_L.8(D) L1.1 R1.2 SW.8(SW)
NetC10_2: C10.2 SW.10(BOOT)
NetFET_H_4: FET_H.4(GATE) SW.9(HG)
NetFET_L_4: FET_L.4(GATE) SW.2(LG)
NetR1_1: R1.1 SW.4(ILIM)

Not connected (* = marked no-connect by the designer): FPGA AF15(VCC_PLL6_OUT) AF16(VCC_PLL12_OUT) J16(VCC_PLL5_OUT) J17(VCC_PLL11_OUT)

### Notes on the sheet
- DIODE?

### Library data of the parts
C1 C3 C4 C6-C10 = Cap Semi: Capacitor (Semiconductor SIM Model); Published: 8-Jun-2000; LatestRevisionDate: 29-May-2009; LatestRevisionNote: IPC-7351 Footprint Added.; PackageReference: C1206; Publisher: Altium Limited; PackageDescription: Chip Capacitor
C2 C5 C11 = Cap Pol3: Polarized Capacitor (Surface Mount); Published: 8-Jun-2000; LatestRevisionDate: 29-May-2009; LatestRevisionNote: IPC-7351 Footprint Added.; PackageReference: C0805; Publisher: Altium Limited; PackageDescription: Chip Capacitor
C12 C13 = T492A: Solid Tantalum Chip Capacitor, T492 Series - CWR11 Style Per Mil-PRF-55365/8; Published: 17-Jul-2002; LatestRevisionDate: 19-Mar-2004; LatestRevisionNote: Silkscreen dimensions re-sized.; DatasheetDocument: Mar-2001; PackageDocument: Mar-2001; PackageReference: A; Publisher: Altium Limited; Code_JEITA: 3216-18; ComponentLink1Description: Manufacturer Link; ComponentLink1URL: http://www.kemet.com/; ComponentLink2Description: Datasheet; ComponentLink2URL: http://www.kemet.com/kemet/web/homepage/kechome.nsf/vapubfilesname/F3102TA.pdf/$file/F3102TA.pdf
FPGA = EP2S90F1020C4N: as FPGA on sheet IO; Published: 8-Jul-2005; LatestRevisionDate: 13-Apr-2006; LatestRevisionNote: IPC-7351 Footprint Added.; DatasheetVersion: ver4.3, Jan-2008; PackageVersion: ver15.1, May-2008; PackageReference: FBGA1020; Publisher: Altium Limited; PackageDescription: 1020-Ball FineLine Ball Grid Array (FBGA1020) - Flip Chip; Code_JEDEC: MS-034-AAP-1; ComponentLink1Description: Manufacturer Link; ComponentLink1URL: http://www.altera.com/products/devices/stratix2/st2-index.jsp; ComponentLink2Description: Handbook; ComponentLink2URL: http://www.altera.com/literature/hb/stx2/stratix2_handbook.pdf; ComponentLink3Description: Packaging Specification; ComponentLink3URL: http://www.altera.com/literature/ds/dspkg.pdf
R1-R6 = Res3: Resistor; Published: 8-Jun-2000; LatestRevisionDate: 29-May-2009; LatestRevisionNote: IPC-7351 Footprint Added.; PackageReference: J1-0603; Publisher: Altium Limited; PackageDescription: Chip Resistor
SW = LM3743MM-300: High-Performance Synchronous Buck Controller with Comprehensive Fault Protection Features; Manufacturer: National Semiconductor; CompType: Switcher; PackageTopMarking: ZXTT*SKPB; PowerWise: Y; Published: 4-Dec-2008; DatasheetVersion: Oct-2008; PackageVersion: revB, Jul-2003; PackageReference: MUB10A; Publisher: Altium Limited; PackageDescription: Mini-SO, Molded, .118 x .118 x .034in Body, 10 Lead, .0197in Pitch; PartNumber: LM3743MM-300; RoHS: Y; PinCount: 10; DigiKeyPartNumber: LM3743MM-300CT-ND; Code_JEDEC: MO-187-BA; ComponentLink1Description: LM3743 Datasheet; ComponentLink1URL: http://www.national.com/ds/LM/LM3743.pdf; ComponentLink2Description: LM3743 Web Page; ComponentLink2URL: http://www.national.com/pf/LM/LM3743.html; ComponentLink3Description: MUB10A Package Page; ComponentLink3URL: http://www.national.com/packaging/folders/mub10a.html
U1 = LM1086IS-3.3: 1.5A Low Dropout Positive Regulators; Manufacturer: National Semiconductor; CompType: LDO IC; PackageTopMarking: NSUZXYTTE#*LM1086*IS-3.3; PowerWise: N; Published: 4-Dec-2008; DatasheetVersion: Jun-2005; PackageVersion: revF, Apr-2005; PackageReference: TS3B; Publisher: Altium Limited; PackageDescription: TO-263, Molded, .400 x .390 x .180in, 3 Lead, .1in Pitch, Surface Mount; PartNumber: LM1086IS-3.3; RoHS: O; PinCount: 3; DigiKeyPartNumber: LM1086IS-3.3-ND; Code_JEDEC: MO-169-AA; ComponentLink1Description: LM1086 Datasheet; ComponentLink1URL: http://www.national.com/ds/LM/LM1086.pdf; ComponentLink2Description: LM1086 Web Page; ComponentLink2URL: http://www.national.com/pf/LM/LM1086.html; ComponentLink3Description: TS3B Package Page; ComponentLink3URL: http://www.national.com/packaging/folders/ts3b.html
FET_H FET_L = Si4156DY: Supplier 1: Farnell
Power = ATX_CONNECTOR: Supplier 1: Newark

## Sheet clk.SchDoc
size A2
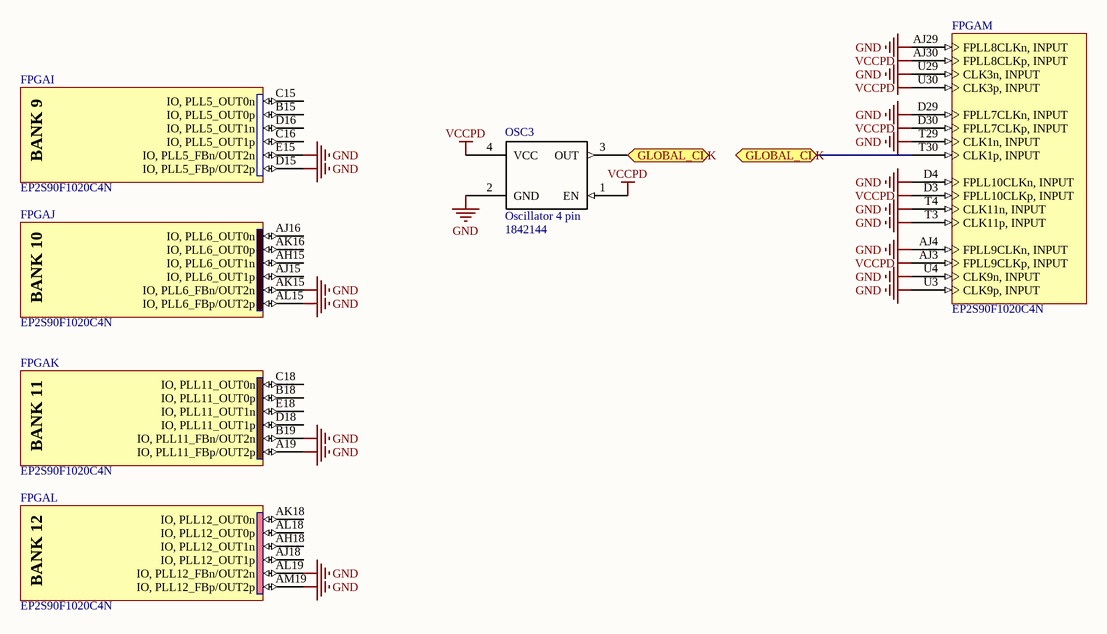
[diagram p3: clk.SchDoc]

### Parts
FPGA  EP2S90F1020C4N  [FBGA1020]  (parts I,J,K,L,M of 18)
OSC3  Oscillator 4 pin  Supplier Part Number 1: 1842144  [SMD Crystal 7x5 mm]

### Ports
GLOBAL_CLK

### Nets
GND: FPGA.A19(IO,_PLL11_FBp/OUT2p) FPGA.AJ4(FPLL9CLKn,_INPUT) FPGA.AJ29(FPLL8CLKn,_INPUT) FPGA.AK15(IO,_PLL6_FBn/OUT2n) FPGA.AL15(IO,_PLL6_FBp/OUT2p) FPGA.AL19(IO,_PLL12_FBn/OUT2n) FPGA.AM19(IO,_PLL12_FBp/OUT2p) FPGA.B19(IO,_PLL11_FBn/OUT2n) FPGA.D4(FPLL10CLKn,_INPUT) FPGA.D15(IO,_PLL5_FBp/OUT2p) FPGA.D29(FPLL7CLKn,_INPUT) FPGA.E15(IO,_PLL5_FBn/OUT2n) FPGA.T3(CLK11p,_INPUT) FPGA.T4(CLK11n,_INPUT) FPGA.T29(CLK1n,_INPUT) FPGA.U3(CLK9p,_INPUT) FPGA.U4(CLK9n,_INPUT) FPGA.U29(CLK3n,_INPUT) OSC3.2(GND)
VCCPD: FPGA.AJ3(FPLL9CLKp,_INPUT) FPGA.AJ30(FPLL8CLKp,_INPUT) FPGA.D3(FPLL10CLKp,_INPUT) FPGA.D30(FPLL7CLKp,_INPUT) FPGA.U30(CLK3p,_INPUT) OSC3.1(EN) OSC3.4(VCC)
NetFPGA_T30: FPGA.T30(CLK1p,_INPUT) OSC3.3(OUT) ; port GLOBAL_CLK

Not connected (* = marked no-connect by the designer): FPGA AH15(IO,_PLL6_OUT1n) AH18(IO,_PLL12_OUT1n) AJ15(IO,_PLL6_OUT1p) AJ16(IO,_PLL6_OUT0n) AJ18(IO,_PLL12_OUT1p) AK16(IO,_PLL6_OUT0p) AK18(IO,_PLL12_OUT0n) AL18(IO,_PLL12_OUT0p) B15(IO,_PLL5_OUT0p) B18(IO,_PLL11_OUT0p) C15(IO,_PLL5_OUT0n) C16(IO,_PLL5_OUT1p) C18(IO,_PLL11_OUT0n) D16(IO,_PLL5_OUT1n) D18(IO,_PLL11_OUT1p) E18(IO,_PLL11_OUT1n)

### Notes on the sheet
- (in symbol EP2S90F1020C4N, part I) BANK 9
- (in symbol EP2S90F1020C4N, part J) BANK 10
- (in symbol EP2S90F1020C4N, part K) BANK 11
- (in symbol EP2S90F1020C4N, part L) BANK 12

### Library data of the parts
FPGA = EP2S90F1020C4N: as FPGA on sheet IO; Published: 8-Jul-2005; LatestRevisionDate: 13-Apr-2006; LatestRevisionNote: IPC-7351 Footprint Added.; DatasheetVersion: ver4.3, Jan-2008; PackageVersion: ver15.1, May-2008; PackageReference: FBGA1020; Publisher: Altium Limited; PackageDescription: 1020-Ball FineLine Ball Grid Array (FBGA1020) - Flip Chip; Code_JEDEC: MS-034-AAP-1; ComponentLink1Description: Manufacturer Link; ComponentLink1URL: http://www.altera.com/products/devices/stratix2/st2-index.jsp; ComponentLink2Description: Handbook; ComponentLink2URL: http://www.altera.com/literature/hb/stx2/stratix2_handbook.pdf; ComponentLink3Description: Packaging Specification; ComponentLink3URL: http://www.altera.com/literature/ds/dspkg.pdf
OSC3 = Oscillator 4 pin: Supplier 1: Farnell

## Sheet configuration.SchDoc
size A4
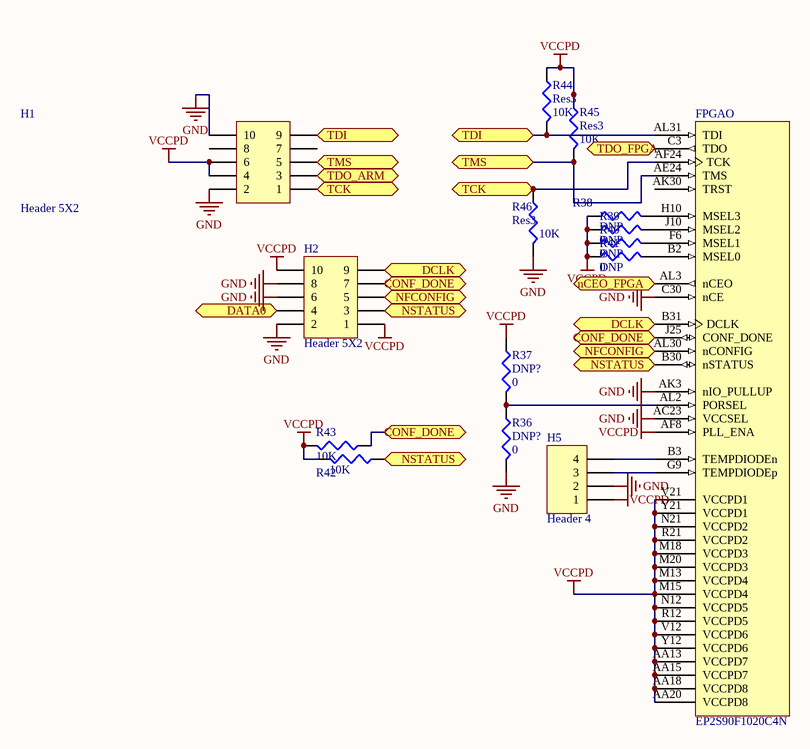
[diagram p4: configuration.SchDoc]

### Parts
FPGA  EP2S90F1020C4N  [FBGA1020]  (part O of 18)
H1  Header 5X2  [HDR2X5]
H2  Header 5X2  [HDR2X5]
H5  Header 4  [HDR1X4]
R36  DNP?  value 0  [RESC1608L]
R37  DNP?  value 0  [RESC1608L]
R38  DNP  value 0  [RESC1608L]
R39  DNP  value 0  [RESC1608L]
R40  DNP  value 0  [RESC1608L]
R41  DNP  value 0  [RESC1608L]
R42  value 10K  [RESC1608L]
R43  value 10K  [RESC1608L]
R44  Res3  value 10K  [RESC1608L]
R45  Res3  value 10K  [RESC1608L]
R46  Res3  value 10K  [RESC1608L]

### Ports
CONF_DONE, DATA0, DCLK, nCEO_FPGA, NFCONFIG, NSTATUS, TCK, TDI, TDO_ARM, TDO_FPGA, TMS

### Nets
GND: FPGA.AC23(VCCSEL) FPGA.AK3(nIO_PULLUP) FPGA.C30(nCE) H1.2 H1.10 H2.2 H2.6 H2.8 H5.2 R36.2 R46.2
VCCPD: FPGA.AA13(VCCPD7) FPGA.AA15(VCCPD7) FPGA.AA18(VCCPD8) FPGA.AA20(VCCPD8) FPGA.AF8(PLL_ENA) FPGA.M13(VCCPD4) FPGA.M15(VCCPD4) FPGA.M18(VCCPD3) FPGA.M20(VCCPD3) FPGA.N12(VCCPD5) FPGA.N21(VCCPD2) FPGA.R12(VCCPD5) FPGA.R21(VCCPD2) FPGA.V12(VCCPD6) FPGA.V21(VCCPD1) FPGA.Y12(VCCPD6) FPGA.Y21(VCCPD1) H1.4 H1.6 H2.1 H2.10 H5.1 R37.1 R38.1 R39.1 R40.1 R41.1 R42.2 R43.2 R44.1 R45.1
NetARM_1: H1.3 ; port TDO_ARM
NetARM_3: FPGA.AE24(TMS) H1.5 R45.2 ; port TMS
NetARM_5: FPGA.AF24(TCK) H1.1 R46.1 ; port TCK
NetARM_52: FPGA.J25(CONF_DONE) H2.7 R43.1 ; port CONF_DONE
NetARM_53: FPGA.AL30(nCONFIG) H2.5 ; port NFCONFIG
NetARM_64: FPGA.B30(nSTATUS) H2.3 R42.1 ; port NSTATUS
NetARM_65: FPGA.B31(DCLK) H2.9 ; port DCLK
NetARM_75: H2.4 ; port DATA0
NetFPGA_AL2: FPGA.AL2(PORSEL) R36.1 R37.2
NetFPGA_AL3: FPGA.AL3(nCEO) ; port nCEO_FPGA
NetFPGA_AL31: FPGA.AL31(TDI) H1.9 R44.2 ; port TDI
NetFPGA_B2: FPGA.B2(MSEL0) R41.2
NetFPGA_B3: FPGA.B3(TEMPDIODEn) H5.4
NetFPGA_C3: FPGA.C3(TDO) ; port TDO_FPGA
NetFPGA_F6: FPGA.F6(MSEL1) R40.2
NetFPGA_G9: FPGA.G9(TEMPDIODEp) H5.3
NetFPGA_H10: FPGA.H10(MSEL3) R38.2
NetFPGA_J10: FPGA.J10(MSEL2) R39.2

Not connected (* = marked no-connect by the designer): FPGA AK30(TRST); H1 7 8

### Library data of the parts
FPGA = EP2S90F1020C4N: as FPGA on sheet IO; Published: 8-Jul-2005; LatestRevisionDate: 13-Apr-2006; LatestRevisionNote: IPC-7351 Footprint Added.; DatasheetVersion: ver4.3, Jan-2008; PackageVersion: ver15.1, May-2008; PackageReference: FBGA1020; Publisher: Altium Limited; PackageDescription: 1020-Ball FineLine Ball Grid Array (FBGA1020) - Flip Chip; Code_JEDEC: MS-034-AAP-1; ComponentLink1Description: Manufacturer Link; ComponentLink1URL: http://www.altera.com/products/devices/stratix2/st2-index.jsp; ComponentLink2Description: Handbook; ComponentLink2URL: http://www.altera.com/literature/hb/stx2/stratix2_handbook.pdf; ComponentLink3Description: Packaging Specification; ComponentLink3URL: http://www.altera.com/literature/ds/dspkg.pdf
H1 H2 = Header 5X2: Header, 5-Pin, Dual row; LatestRevisionDate: 17-Jul-2002; LatestRevisionNote: Re-released for DXP Platform.; Publisher: Altium Limited
H5 = Header 4: Header, 4-Pin; LatestRevisionDate: 17-Jul-2002; LatestRevisionNote: Re-released for DXP Platform.; Publisher: Altium Limited
R36-R46 = Res3: Resistor; Published: 8-Jun-2000; LatestRevisionDate: 29-May-2009; LatestRevisionNote: IPC-7351 Footprint Added.; PackageReference: J1-0603; Publisher: Altium Limited; PackageDescription: Chip Resistor

## Sheet arm.SchDoc
size A3
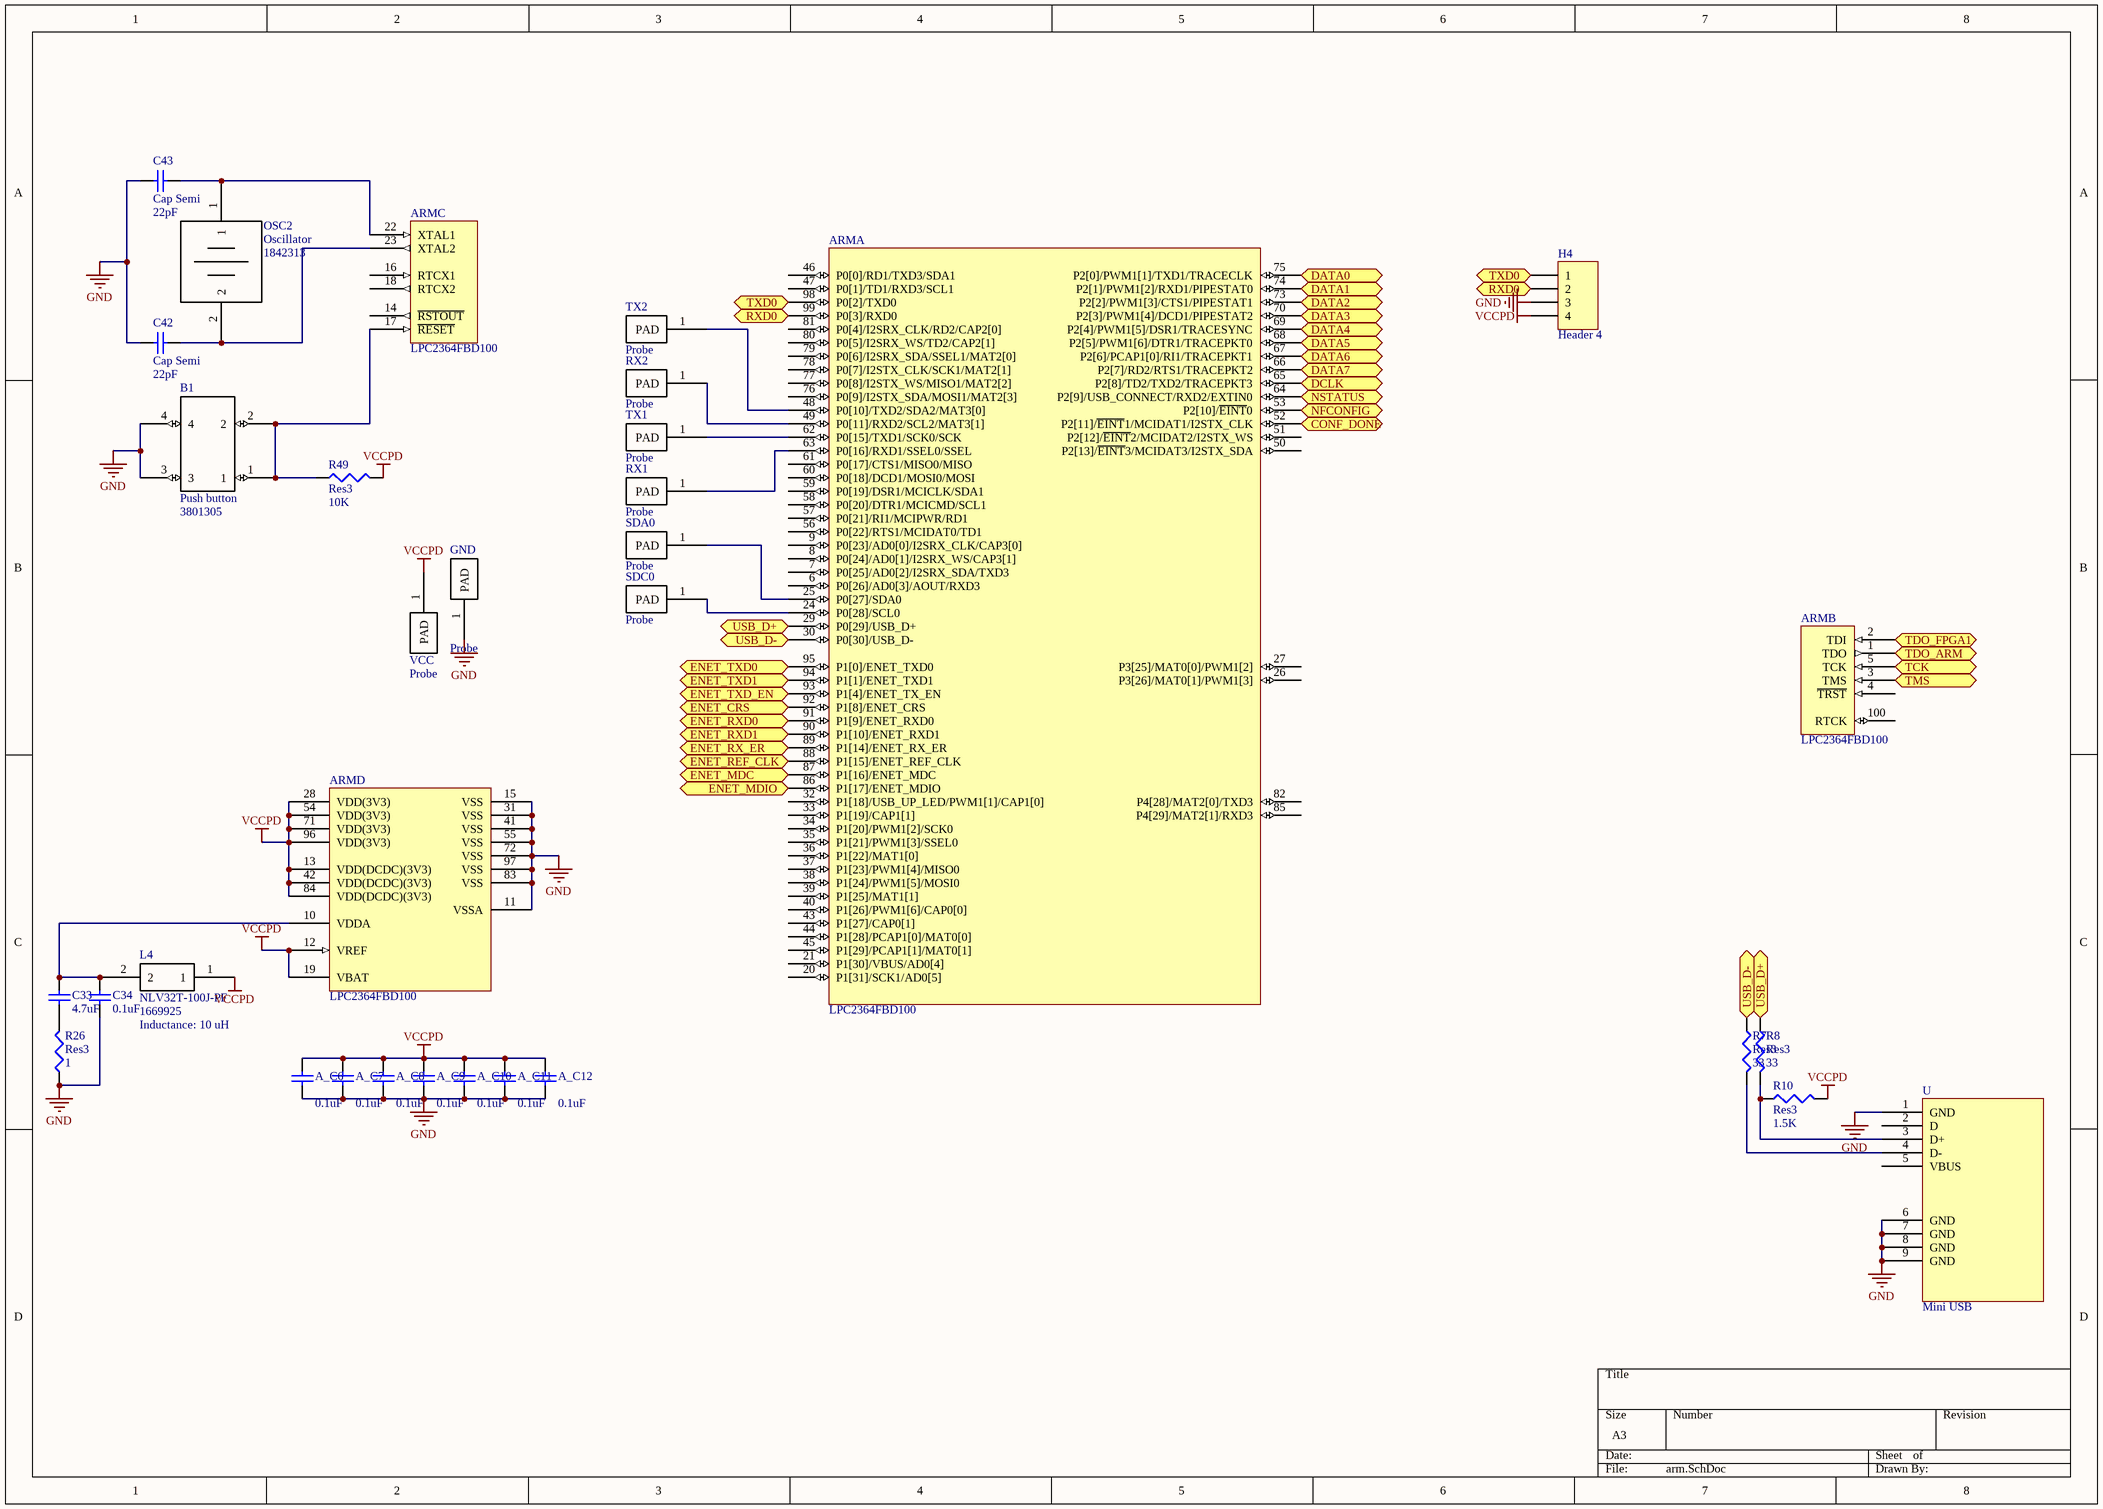
[diagram p5: arm.SchDoc]

### Parts
A_C6  value 0.1uF  [CAPC1608L]  (hidden comment: Cap Semi)
A_C7  value 0.1uF  [CAPC1608L]  (hidden comment: Cap Semi)
A_C8  value 0.1uF  [CAPC1608L]  (hidden comment: Cap Semi)
A_C9  value 0.1uF  [CAPC1608L]  (hidden comment: Cap Semi)
A_C10  value 0.1uF  [CAPC1608L]  (hidden comment: Cap Semi)
A_C11  value 0.1uF  [CAPC1608L]  (hidden comment: Cap Semi)
A_C12  value 0.1uF  [CAPC1608L]  (hidden comment: Cap Semi)
ARM  LPC2364FBD100  [SOT407-1_N]  (parts A,B,C,D of 4)
B1  Push button  Supplier Part Number 1: 3801305  [SMD Button]
C33  value 4.7uF  [CAPC1608L]  (hidden comment: Cap Semi)
C34  value 0.1uF  [CAPC1608L]  (hidden comment: Cap Semi)
C42  Cap Semi  value 22pF  [CAPC1608L]
C43  Cap Semi  value 22pF  [CAPC1608L]
GND  Probe  [Probe pad]
H4  Header 4  [HDR1X4]
L4  NLV32T-100J-PF  Supplier Part Number 1: 1669925  Inductance: 10 uH  [INDC3225X22N]
OSC2  Oscillator  Supplier Part Number 1: 1842313  [HC49/4H_SMX]
R7  Res3  value 33  [RESC1608L]
R8  Res3  value 33  [RESC1608L]
R10  Res3  value 1.5K  [RESC1608L]
R26  Res3  value 1  [RESC1608L]
R49  Res3  value 10K  [RESC1608L]
RX1  Probe  [Probe pad]
RX2  Probe  [Probe pad]
SDA0  Probe  [Probe pad]
SDC0  Probe  [Probe pad]
TX1  Probe  [Probe pad]
TX2  Probe  [Probe pad]
U  Mini USB  [Mini USB B]
VCC  Probe  [Probe pad]

### Ports
CONF_DONE, DATA0, DATA1, DATA2, DATA3, DATA4, DATA5, DATA6, DATA7, DCLK, ENET_CRS, ENET_MDC, ENET_MDIO, ENET_REF_CLK, ENET_RX_ER, ENET_RXD0, ENET_RXD1, ENET_TXD0, ENET_TXD1, ENET_TXD_EN, NFCONFIG, NSTATUS, RXD0, TCK, TDO_ARM, TDO_FPGA1, TMS, TXD0, USB_D+, USB_D-

### Nets
GND: A_C6.2 A_C7.2 A_C8.2 A_C9.2 A_C10.2 A_C11.2 A_C12.2 ARM.11(VSSA) ARM.15(VSS) ARM.31(VSS) ARM.41(VSS) ARM.55(VSS) ARM.72(VSS) ARM.83(VSS) ARM.97(VSS) B1.3 B1.4 C34.2 C42.1 C43.1 GND.1(PAD) H4.3 R26.1 U.1(GND) U.6(GND) U.7(GND) U.8(GND) U.9(GND)
VCCPD: A_C6.1 A_C7.1 A_C8.1 A_C9.1 A_C10.1 A_C11.1 A_C12.1 ARM.12(VREF) ARM.13(VDD(DCDC)(3V3)) ARM.19(VBAT) ARM.28(VDD(3V3)) ARM.42(VDD(DCDC)(3V3)) ARM.54(VDD(3V3)) ARM.71(VDD(3V3)) ARM.84(VDD(DCDC)(3V3)) ARM.96(VDD(3V3)) H4.4 L4.1 R10.2 R49.2 VCC.1(PAD)
NetARM_1: ARM.1(TDO) ; port TDO_ARM
NetARM_2: ARM.2(TDI) ; port TDO_FPGA1
NetARM_3: ARM.3(TMS) ; port TMS
NetARM_5: ARM.5(TCK) ; port TCK
NetARM_10: ARM.10(VDDA) C33.1 C34.1 L4.2
NetARM_17: ARM.17(~{RESET}) B1.1 B1.2 R49.1
NetARM_22: ARM.22(XTAL1) C43.2 OSC2.1
NetARM_23: ARM.23(XTAL2) C42.2 OSC2.2
NetARM_24: ARM.24(P0[28]/SCL0) SDC0.1(PAD)
NetARM_25: ARM.25(P0[27]/SDA0) SDA0.1(PAD)
NetARM_29: ARM.29(P0[29]/USB_D+) R8.1 ; port USB_D+
NetARM_30: ARM.30(P0[30]/USB_D-) R7.1 ; port USB_D-
NetARM_48: ARM.48(P0[10]/TXD2/SDA2/MAT3[0]) TX2.1(PAD)
NetARM_49: ARM.49(P0[11]/RXD2/SCL2/MAT3[1]) RX2.1(PAD)
NetARM_52: ARM.52(P2[11]/~{EINT}1/MCIDAT1/I2STX_CLK) ; port CONF_DONE
NetARM_53: ARM.53(P2[10]/~{EINT}0) ; port NFCONFIG
NetARM_62: ARM.62(P0[15]/TXD1/SCK0/SCK) TX1.1(PAD)
NetARM_63: ARM.63(P0[16]/RXD1/SSEL0/SSEL) RX1.1(PAD)
NetARM_64: ARM.64(P2[9]/USB_CONNECT/RXD2/EXTIN0) ; port NSTATUS
NetARM_65: ARM.65(P2[8]/TD2/TXD2/TRACEPKT3) ; port DCLK
NetARM_66: ARM.66(P2[7]/RD2/RTS1/TRACEPKT2) ; port DATA7
NetARM_67: ARM.67(P2[6]/PCAP1[0]/RI1/TRACEPKT1) ; port DATA6
NetARM_68: ARM.68(P2[5]/PWM1[6]/DTR1/TRACEPKT0) ; port DATA5
NetARM_69: ARM.69(P2[4]/PWM1[5]/DSR1/TRACESYNC) ; port DATA4
NetARM_70: ARM.70(P2[3]/PWM1[4]/DCD1/PIPESTAT2) ; port DATA3
NetARM_73: ARM.73(P2[2]/PWM1[3]/CTS1/PIPESTAT1) ; port DATA2
NetARM_74: ARM.74(P2[1]/PWM1[2]/RXD1/PIPESTAT0) ; port DATA1
NetARM_75: ARM.75(P2[0]/PWM1[1]/TXD1/TRACECLK) ; port DATA0
NetARM_86: ARM.86(P1[17]/ENET_MDIO) ; port ENET_MDIO
NetARM_87: ARM.87(P1[16]/ENET_MDC) ; port ENET_MDC
NetARM_88: ARM.88(P1[15]/ENET_REF_CLK) ; port ENET_REF_CLK
NetARM_89: ARM.89(P1[14]/ENET_RX_ER) ; port ENET_RX_ER
NetARM_90: ARM.90(P1[10]/ENET_RXD1) ; port ENET_RXD1
NetARM_91: ARM.91(P1[9]/ENET_RXD0) ; port ENET_RXD0
NetARM_92: ARM.92(P1[8]/ENET_CRS) ; port ENET_CRS
NetARM_93: ARM.93(P1[4]/ENET_TX_EN) ; port ENET_TXD_EN
NetARM_94: ARM.94(P1[1]/ENET_TXD1) ; port ENET_TXD1
NetARM_95: ARM.95(P1[0]/ENET_TXD0) ; port ENET_TXD0
NetARM_98: ARM.98(P0[2]/TXD0) H4.1 ; port TXD0
NetARM_99: ARM.99(P0[3]/RXD0) H4.2 ; port RXD0
NetC33_2: C33.2 R26.2
NetR7_2: R7.2 U.4(D-)
NetR8_2: R8.2 R10.1 U.3(D+)

Not connected (* = marked no-connect by the designer): ARM 4(~{TRST}) 6(P0[26]/AD0[3]/AOUT/RXD3) 7(P0[25]/AD0[2]/I2SRX_SDA/TXD3) 8(P0[24]/AD0[1]/I2SRX_WS/CAP3[1]) 9(P0[23]/AD0[0]/I2SRX_CLK/CAP3[0]) 14(~{RSTOUT}) 16(RTCX1) 18(RTCX2) 20(P1[31]/SCK1/AD0[5]) 21(P1[30]/VBUS/AD0[4]) 26(P3[26]/MAT0[1]/PWM1[3]) 27(P3[25]/MAT0[0]/PWM1[2]) 32(P1[18]/USB_UP_LED/PWM1[1]/CAP1[0]) 33(P1[19]/CAP1[1]) 34(P1[20]/PWM1[2]/SCK0) 35(P1[21]/PWM1[3]/SSEL0) 36(P1[22]/MAT1[0]) 37(P1[23]/PWM1[4]/MISO0) 38(P1[24]/PWM1[5]/MOSI0) 39(P1[25]/MAT1[1]) 40(P1[26]/PWM1[6]/CAP0[0]) 43(P1[27]/CAP0[1]) 44(P1[28]/PCAP1[0]/MAT0[0]) 45(P1[29]/PCAP1[1]/MAT0[1]) 46(P0[0]/RD1/TXD3/SDA1) 47(P0[1]/TD1/RXD3/SCL1) 50(P2[13]/~{EINT}3/MCIDAT3/I2STX_SDA) 51(P2[12]/~{EINT}2/MCIDAT2/I2STX_WS) 56(P0[22]/RTS1/MCIDAT0/TD1) 57(P0[21]/RI1/MCIPWR/RD1) 58(P0[20]/DTR1/MCICMD/SCL1) 59(P0[19]/DSR1/MCICLK/SDA1) 60(P0[18]/DCD1/MOSI0/MOSI) 61(P0[17]/CTS1/MISO0/MISO) 76(P0[9]/I2STX_SDA/MOSI1/MAT2[3]) 77(P0[8]/I2STX_WS/MISO1/MAT2[2]) 78(P0[7]/I2STX_CLK/SCK1/MAT2[1]) 79(P0[6]/I2SRX_SDA/SSEL1/MAT2[0]) 80(P0[5]/I2SRX_WS/TD2/CAP2[1]) 81(P0[4]/I2SRX_CLK/RD2/CAP2[0]) 82(P4[28]/MAT2[0]/TXD3) 85(P4[29]/MAT2[1]/RXD3) 100(RTCK); U 2(D) 5(VBUS)

### Library data of the parts
A_C6-A_C12 C33 C34 C42 C43 = Cap Semi: Capacitor (Semiconductor SIM Model); Published: 8-Jun-2000; LatestRevisionDate: 29-May-2009; LatestRevisionNote: IPC-7351 Footprint Added.; PackageReference: C1206; Publisher: Altium Limited; PackageDescription: Chip Capacitor
ARM = LPC2364FBD100: ARM7 16/32-Bit Microcontroller, 128KB Flash, 34KB RAM, 4 Channel CAN, 100-Lead LQFP; Code_IEC: 136E20; Published: 17-Aug-2007; DatasheetVersion: rev.01, Jan-2007; PackageVersion: Feb-2003; PackageReference: SOT407-1; Publisher: Altium Limited; PackageDescription: 100-Pin Plastic Low Profile Quad Flat Pack, LQFP100; Code_JEDEC: MS-026; ComponentLink1Description: Manufacturer Link; ComponentLink1URL: http://www.nxp.com/; ComponentLink2Description: Datasheet; ComponentLink2URL: http://www.standardics.nxp.com/products/lpc2000/datasheet/lpc2364.lpc2366.lpc2368.pdf
H4 = Header 4: Header, 4-Pin; LatestRevisionDate: 17-Jul-2002; LatestRevisionNote: Re-released for DXP Platform.; Publisher: Altium Limited
L4 = NLV32T-100J-PF: Current rating: 150 mA; Supplier 1: Farnell
OSC2 = Oscillator: Frequency: 25MHZ; Supplier 1: Farnell
R7 R8 R10 R26 R49 = Res3: Resistor; Published: 8-Jun-2000; LatestRevisionDate: 29-May-2009; LatestRevisionNote: IPC-7351 Footprint Added.; PackageReference: J1-0603; Publisher: Altium Limited; PackageDescription: Chip Resistor
B1 = Push button: Supplier 1: Farnell

## Sheet ethernet.SchDoc
size A3
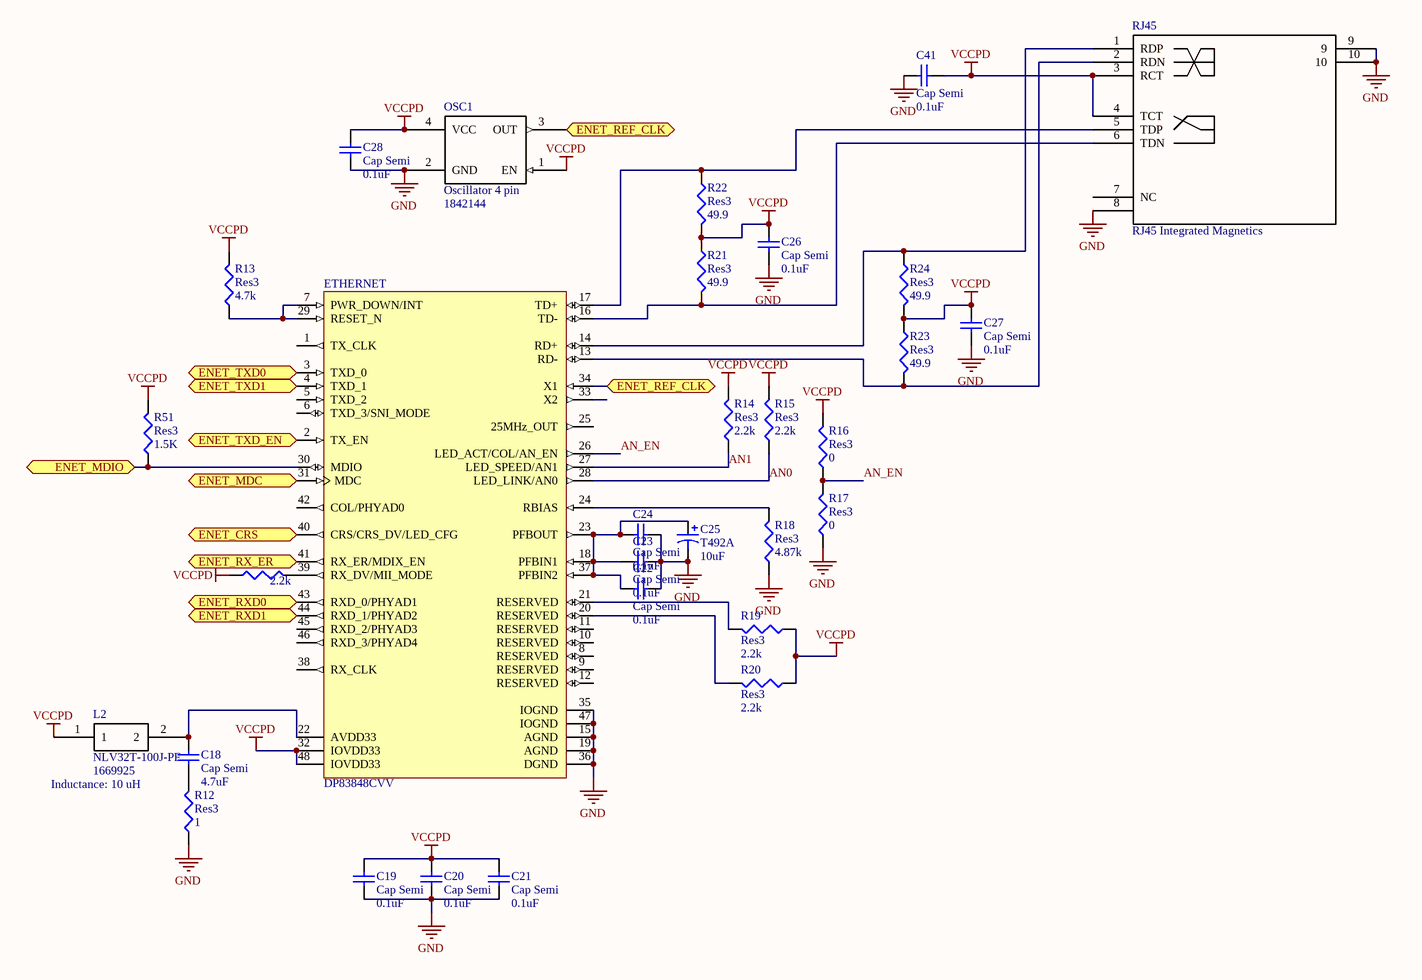
[diagram p6: ethernet.SchDoc]

### Parts
C18  Cap Semi  value 4.7uF  [CAPC1608L]
C19  Cap Semi  value 0.1uF  [CAPC1608L]
C20  Cap Semi  value 0.1uF  [CAPC1608L]
C21  Cap Semi  value 0.1uF  [CAPC1608L]
C22  Cap Semi  value 0.1uF  [CAPC1608L]
C23  Cap Semi  value 0.1uF  [CAPC1608L]
C24  Cap Semi  value 0.1uF  [CAPC1608L]
C25  T492A  value 10uF  [A]
C26  Cap Semi  value 0.1uF  [CAPC1608L]
C27  Cap Semi  value 0.1uF  [CAPC1608L]
C28  Cap Semi  value 0.1uF  [CAPC1608L]
C41  Cap Semi  value 0.1uF  [CAPC1608L]
ETHERNET  DP83848CVV  [VBH48A_N]
L2  NLV32T-100J-PF  Supplier Part Number 1: 1669925  Inductance: 10 uH  [INDC3225X22N]
OSC1  Oscillator 4 pin  Supplier Part Number 1: 1842144  [SMD Crystal 7x5 mm]
R12  Res3  value 1  [RESC1608L]
R13  Res3  value 4.7k  [RESC1608L]
R14  Res3  value 2.2k  [RESC1608L]
R15  Res3  value 2.2k  [RESC1608L]
R16  Res3  value 0  [RESC1608L]
R17  Res3  value 0  [RESC1608L]
R18  Res3  value 4.87k  [RESC1608L]
R19  Res3  value 2.2k  [RESC1608L]
R20  Res3  value 2.2k  [RESC1608L]
R21  Res3  value 49.9  [RESC1608L]
R22  Res3  value 49.9  [RESC1608L]
R23  Res3  value 49.9  [RESC1608L]
R24  Res3  value 49.9  [RESC1608L]
R33  value 2.2k  [RESC1608L]
R51  Res3  value 1.5K  [RESC1608L]
RJ45  RJ45 Integrated Magnetics  [RJ45]

### Ports
ENET_CRS, ENET_MDC, ENET_MDIO, ENET_REF_CLK, ENET_RX_ER, ENET_RXD0, ENET_RXD1, ENET_TXD0, ENET_TXD1, ENET_TXD_EN

### Nets
GND: C19.2 C20.2 C21.2 C22.2 C23.2 C24.2 C25.2 C26.1 C27.1 C28.2 C41.1 ETHERNET.15(AGND) ETHERNET.19(AGND) ETHERNET.35(IOGND) ETHERNET.36(DGND) ETHERNET.47(IOGND) OSC1.2(GND) R12.1 R17.1 R18.1 RJ45.8 RJ45.9 RJ45.10
VCCPD: C19.1 C20.1 C21.1 C26.2 C27.2 C28.1 C41.2 ETHERNET.32(IOVDD33) ETHERNET.48(IOVDD33) L2.1 OSC1.1(EN) OSC1.4(VCC) R13.2 R14.2 R15.2 R16.2 R19.1 R20.1 R21.1 R22.2 R23.1 R24.2 R33.1 R51.2 RJ45.3(RCT) RJ45.4(TCT)
AN0: ETHERNET.28(LED_LINK/AN0) R15.1
AN1: ETHERNET.27(LED_SPEED/AN1) R14.1
AN_EN: ETHERNET.26(LED_ACT/COL/AN_EN) R16.1 R17.2
NetARM_86: ETHERNET.30(MDIO) R51.1 ; port ENET_MDIO
NetARM_87: ETHERNET.31(MDC) ; port ENET_MDC
NetARM_88: ETHERNET.34(X1) OSC1.3(OUT) ; port ENET_REF_CLK
NetARM_89: ETHERNET.41(RX_ER/MDIX_EN) ; port ENET_RX_ER
NetARM_90: ETHERNET.44(RXD_1/PHYAD2) ; port ENET_RXD1
NetARM_91: ETHERNET.43(RXD_0/PHYAD1) ; port ENET_RXD0
NetARM_92: ETHERNET.40(CRS/CRS_DV/LED_CFG) ; port ENET_CRS
NetARM_93: ETHERNET.2(TX_EN) ; port ENET_TXD_EN
NetARM_94: ETHERNET.4(TXD_1) ; port ENET_TXD1
NetARM_95: ETHERNET.3(TXD_0) ; port ENET_TXD0
NetC18_1: C18.1 ETHERNET.22(AVDD33) L2.2
NetC18_2: C18.2 R12.2
NetC22_1: C22.1 C23.1 C24.1 C25.1 ETHERNET.18(PFBIN1) ETHERNET.23(PFBOUT) ETHERNET.37(PFBIN2)
NetETHERNET_7: ETHERNET.7(PWR_DOWN/INT) ETHERNET.29(RESET_N) R13.1
NetETHERNET_13: ETHERNET.13(RD-) R23.2 RJ45.2(RDN)
NetETHERNET_14: ETHERNET.14(RD+) R24.1 RJ45.1(RDP)
NetETHERNET_16: ETHERNET.16(TD-) R21.2 RJ45.6(TDN)
NetETHERNET_17: ETHERNET.17(TD+) R22.1 RJ45.5(TDP)
NetETHERNET_20: ETHERNET.20(RESERVED) R20.2
NetETHERNET_21: ETHERNET.21(RESERVED) R19.2
NetETHERNET_24: ETHERNET.24(RBIAS) R18.2
NetETHERNET_39: ETHERNET.39(RX_DV/MII_MODE) R33.2

Not connected (* = marked no-connect by the designer): ETHERNET 1(TX_CLK) 5(TXD_2) 6(TXD_3/SNI_MODE) 8(RESERVED) 9(RESERVED) 10(RESERVED) 11(RESERVED) 12(RESERVED) 25(25MHz_OUT) 33(X2) 38(RX_CLK) 42(COL/PHYAD0) 45(RXD_2/PHYAD3) 46(RXD_3/PHYAD4); RJ45 7(NC)

### Library data of the parts
C18-C24 C26-C28 C41 = Cap Semi: Capacitor (Semiconductor SIM Model); Published: 8-Jun-2000; LatestRevisionDate: 29-May-2009; LatestRevisionNote: IPC-7351 Footprint Added.; PackageReference: C1206; Publisher: Altium Limited; PackageDescription: Chip Capacitor
C25 = T492A: as C12 on sheet power_supply; Published: 17-Jul-2002; LatestRevisionDate: 19-Mar-2004; LatestRevisionNote: Silkscreen dimensions re-sized.; DatasheetDocument: Mar-2001; PackageDocument: Mar-2001; PackageReference: A; Publisher: Altium Limited; Code_JEITA: 3216-18; ComponentLink1Description: Manufacturer Link; ComponentLink1URL: http://www.kemet.com/; ComponentLink2Description: Datasheet; ComponentLink2URL: http://www.kemet.com/kemet/web/homepage/kechome.nsf/vapubfilesname/F3102TA.pdf/$file/F3102TA.pdf
ETHERNET = DP83848CVV: PHYTER® Commercial Temperature Single Port 10/100 Mb/s Ethernet Physical Layer Transceiver; Manufacturer: National Semiconductor; CompType: Interface IC; PackageTopMarking: NSUZXYTT*DP83848VV*VBC; PowerWise: N; Published: 4-Dec-2008; DatasheetVersion: Feb-2007; PackageVersion: revE, May-2007; PackageReference: VBH48A; Publisher: Altium Limited; PackageDescription: LQFP, 7 x 7 x 1.4mm, 48 Lead, 0.5mm Pitch; PartNumber: DP83848CVV; RoHS: Y; PinCount: 48; DigiKeyPartNumber: DP83848CVV-ND; ComponentLink1Description: DP83848C Datasheet; ComponentLink1URL: http://www.national.com/ds/DP/DP83848C.pdf; ComponentLink2Description: DP83848C Web Page; ComponentLink2URL: http://www.national.com/pf/DP/DP83848C.html; ComponentLink3Description: VBH48A Package Page; ComponentLink3URL: http://www.national.com/packaging/folders/vbh48a.html
L2 = NLV32T-100J-PF: Current rating: 150 mA; Supplier 1: Farnell
R12-R24 R33 R51 = Res3: Resistor; Published: 8-Jun-2000; LatestRevisionDate: 29-May-2009; LatestRevisionNote: IPC-7351 Footprint Added.; PackageReference: J1-0603; Publisher: Altium Limited; PackageDescription: Chip Resistor
OSC1 = Oscillator 4 pin: Supplier 1: Farnell

## Sheet memory.SchDoc
size A3